# EAGLE design AutoTunerV2 (EAGLE 9.6.2)

## Sheet 1 of 4: mcu
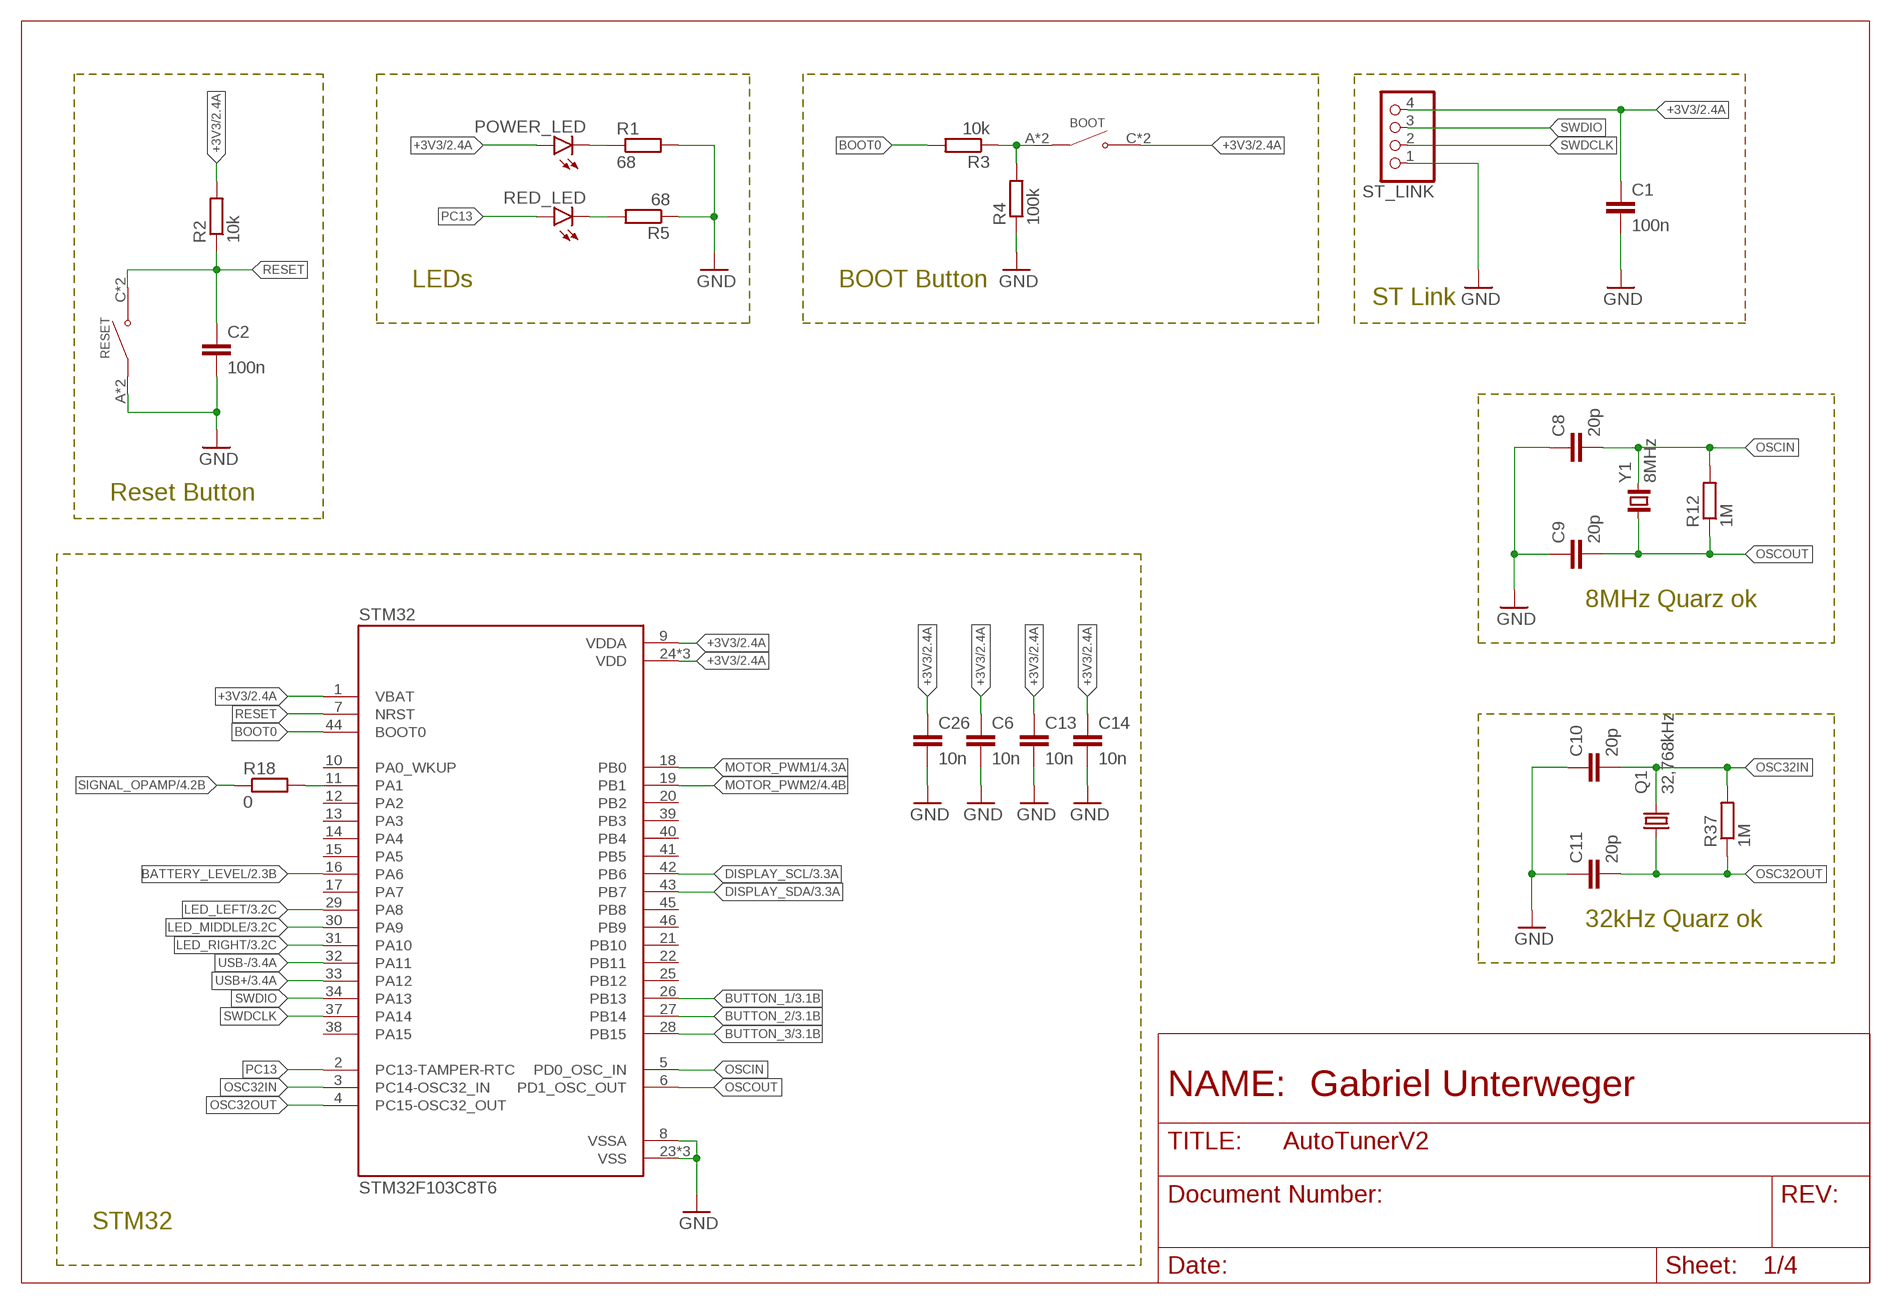
[diagram p0: schematic, sheet 1]

### Parts
BOOT  TS-1187A-B-A-B  [SW_TS-1187A-B-A-B]
C1  100n  C-EUC0805  [C0805]
C2  100n  C-EUC0805  [C0805]
C6  10n  C-EUC0805  [C0805]
C8  20p  C-EUC0805  [C0805]
C9  20p  C-EUC0805  [C0805]
C10  20p  C-EUC0805  [C0805]
C11  20p  C-EUC0805  [C0805]
C13  10n  C-EUC0805  [C0805]
C14  10n  C-EUC0805  [C0805]
C26  10n  C-EUC0805  [C0805]
POWER_LED  LEDCHIPLED_0805  [CHIPLED_0805]
Q1  32,768kHz  KX-327-NHF  [3.2X1.5]
R1  68  R-EU_R0805  [R0805]
R2  10k  R-EU_R0805  [R0805]
R3  10k  R-EU_R0805  [R0805]
R4  100k  R-EU_R0805  [R0805]
R5  68  R-EU_R0805  [R0805]
R12  1M  R-EU_R0805  [R0805]
R18  0  R-EU_R0805  [R0805]
R37  1M  R-EU_R0805  [R0805]
RED_LED  LEDCHIPLED_0805  [CHIPLED_0805]
RESET  TS-1187A-B-A-B  [SW_TS-1187A-B-A-B]
ST_LINK  PINHD-1X4  [1X04]
STM32  STM32F103C8T6  [QFP50P900X900X160-48N]
Y1  8MHz  CRYSTAL_NX5032GA  [CRYSTAL_2-SMD-5X3]

### Nets
+3V3: BOOT.C(NO) BOOT.D(NO) C1.1 C6.1 C13.1 C14.1 C26.1 POWER_LED.A R2.2 ST_LINK.4 STM32.1(VBAT) STM32.9(VDDA) STM32.24(VDD) STM32.36(VDD) STM32.48(VDD) ; also sheet 2,3,4
BATTERY_LEVEL: STM32.16(PA6) ; also sheet 2
BOOT0: R3.2 STM32.44(BOOT0)
BUTTON_1: STM32.26(PB13) ; also sheet 3
BUTTON_2: STM32.27(PB14) ; also sheet 3
BUTTON_3: STM32.28(PB15) ; also sheet 3
DISPLAY_SCL: STM32.42(PB6) ; also sheet 3
DISPLAY_SDA: STM32.43(PB7) ; also sheet 3
GND: C1.2 C2.2 C6.2 C8.1 C9.1 C10.1 C11.1 C13.2 C14.2 C26.2 R1.2 R4.1 R5.1 RESET.A(COM) RESET.B(COM) ST_LINK.1 STM32.8(VSSA) STM32.23(VSS) STM32.35(VSS) STM32.47(VSS) ; also sheet 2,3,4
LED_LEFT: STM32.29(PA8) ; also sheet 3
LED_MIDDLE: STM32.30(PA9) ; also sheet 3
LED_RIGHT: STM32.31(PA10) ; also sheet 3
MOTOR_PWM1: STM32.18(PB0) ; also sheet 4
MOTOR_PWM2: STM32.19(PB1) ; also sheet 4
N$2: R5.2 RED_LED.C
N$3: POWER_LED.C R1.1
N$5: BOOT.A(COM) BOOT.B(COM) R3.1 R4.2
N$45: R18.2 STM32.11(PA1)
OSC32IN: C10.2 Q1.2 R37.2 STM32.3(PC14-OSC32_IN)
OSC32OUT: C11.2 Q1.1 R37.1 STM32.4(PC15-OSC32_OUT)
OSCIN: C8.2 R12.2 STM32.5(PD0_OSC_IN) Y1.2
OSCOUT: C9.2 R12.1 STM32.6(PD1_OSC_OUT) Y1.1
PC13: RED_LED.A STM32.2(PC13-TAMPER-RTC)
RESET: C2.1 R2.1 RESET.C(NO) RESET.D(NO) STM32.7(NRST)
SIGNAL_OPAMP: R18.1 ; also sheet 4
SWDCLK: ST_LINK.2 STM32.37(PA14)
SWDIO: ST_LINK.3 STM32.34(PA13)
USB+: STM32.33(PA12) ; also sheet 3
USB-: STM32.32(PA11) ; also sheet 3
Unconnected: STM32.10(PA0_WKUP) STM32.12(PA2) STM32.13(PA3) STM32.14(PA4) STM32.15(PA5) STM32.17(PA7) STM32.20(PB2) STM32.21(PB10) STM32.22(PB11) STM32.25(PB12) STM32.38(PA15) STM32.39(PB3) STM32.40(PB4) STM32.41(PB5) STM32.45(PB8) STM32.46(PB9)

### Notes on the sheet
- LEDs | BOOT Button
- ST Link
- Reset Button
- 8MHz Quarz ok
- 32kHz Quarz ok
- STM32

## Sheet 2 of 4: battery / voltage converter
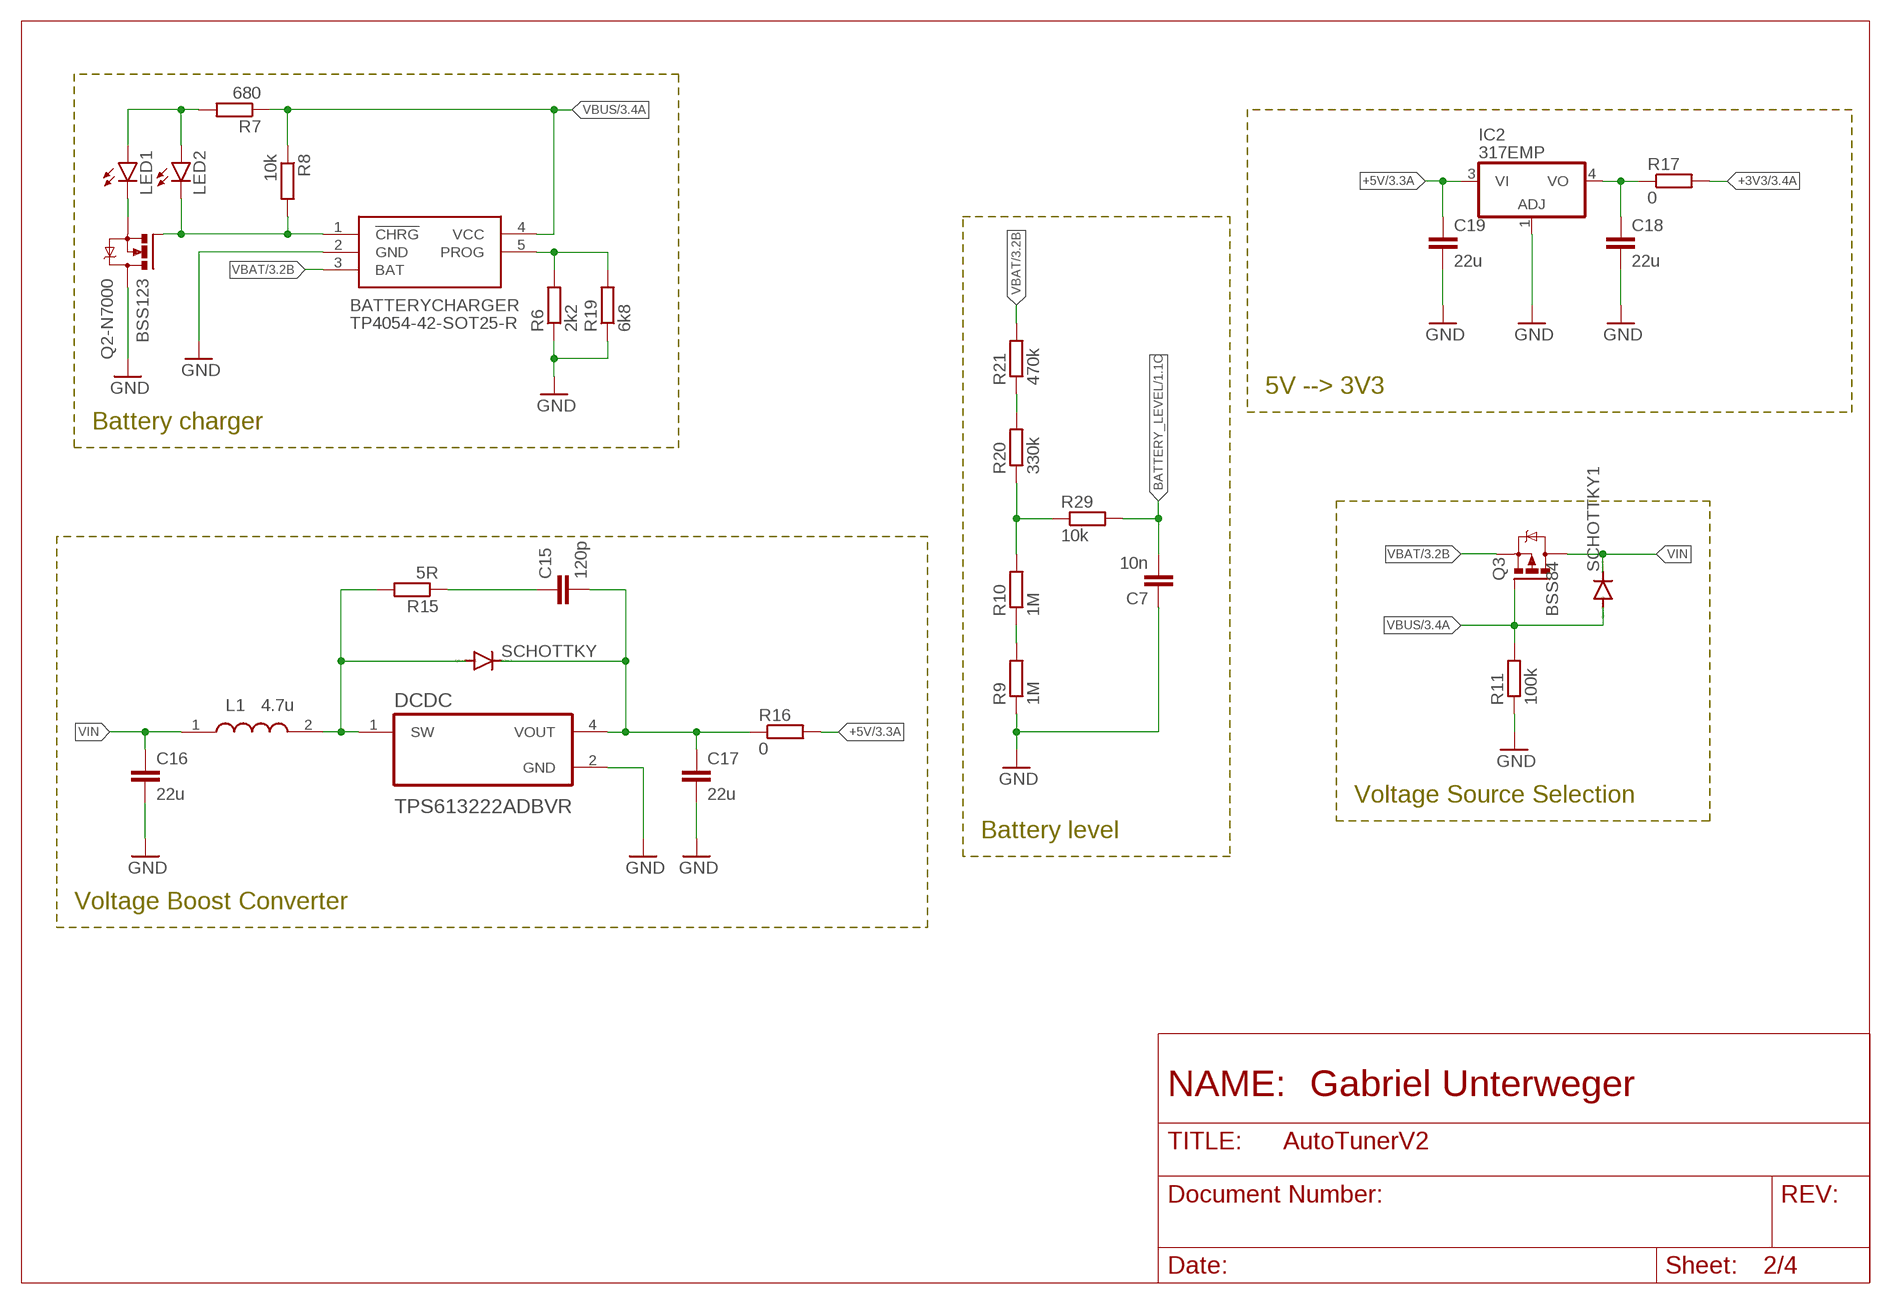
[diagram p1: schematic, sheet 2]

### Parts
BATTERYCHARGER  TP4054-42-SOT25-R  [SOT95P280X100-5N]
C7  10n  C-EUC0805  [C0805]
C15  120p  C-EUC0805  [C0805]
C16  22u  C-EUC1206  [C1206]
C17  22u  C-EUC1206  [C1206]
C18  22u  C-EUC1206  [C1206]
C19  22u  C-EUC1206  [C1206]
DCDC  TPS613222ADBVR  [SOT95P280X145-5N]
IC2  317EMP  [SOT223]
L1  4.7u  DFE252012P-4R7M=P2  [DFE2HCAH1R0MJ0L]
LED1  LEDCHIPLED_0805  [CHIPLED_0805]
LED2  LEDCHIPLED_0805  [CHIPLED_0805]
Q2-N7000  BSS123  NMOSFET_BSS123_SOT23-GSD  [SOT23]
Q3  BSS84  PMOSFET_BSS84_SOT23-GSD  [SOT23]
R6  2k2  R-EU_R0805  [R0805]
R7  680  R-EU_R0805  [R0805]
R8  10k  R-EU_R0805  [R0805]
R9  1M  R-EU_R0805  [R0805]
R10  1M  R-EU_R0805  [R0805]
R11  100k  R-EU_R0805  [R0805]
R15  5R  R-EU_R0805  [R0805]
R16  0  R-EU_R0805  [R0805]
R17  0  R-EU_R0805  [R0805]
R19  6k8  R-EU_R0805  [R0805]
R20  330k  R-EU_R0805  [R0805]
R21  470k  R-EU_R0805  [R0805]
R29  10k  R-EU_R0805  [R0805]
SCHOTTKY  DIODE-SOD323-R  [SOD323-R]
SCHOTTKY1  DIODE-SOD323-R  [SOD323-R]

### Nets
+3V3: R17.2 ; also sheet 1,3,4
+5V: C19.1 IC2.3(VI) R16.2 ; also sheet 3
BATTERY_LEVEL: C7.2 R29.2 ; also sheet 1
GND: BATTERYCHARGER.2(GND) C7.1 C16.2 C17.2 C18.2 C19.2 DCDC.2(GND) IC2.1(ADJ) Q2-N7000.3(D) R6.1 R9.1 R11.1 R19.1 ; also sheet 1,3,4
N$1: DCDC.1(SW) L1.2 R15.2 SCHOTTKY.A
N$4: R9.2 R10.1
N$7: C15.2 C17.1 DCDC.4(VOUT) R16.1 SCHOTTKY.C
N$8: BATTERYCHARGER.5(PROG) R6.2 R19.2
N$9: BATTERYCHARGER.1(!CHRG) LED2.C Q2-N7000.1(G) R8.2
N$10: C15.1 R15.1
N$11: LED1.A LED2.A R7.2
N$12: LED1.C Q2-N7000.2(S)
N$13: C18.1 IC2.4(VO) R17.1
N$46: R20.2 R21.1
N$47: R10.2 R20.1 R29.1
VBAT: BATTERYCHARGER.3(BAT) Q3.2(S) R21.2 ; also sheet 3,4
VBUS: BATTERYCHARGER.4(VCC) Q3.1(G) R7.1 R8.1 R11.2 SCHOTTKY1.A ; also sheet 3
VIN: C16.1 L1.1 Q3.3(D) SCHOTTKY1.C

### Notes on the sheet
- 5V --> 3V3
- Battery charger
- Voltage Source Selection
- Battery level
- Voltage Boost Converter

## Sheet 3 of 4: I/O
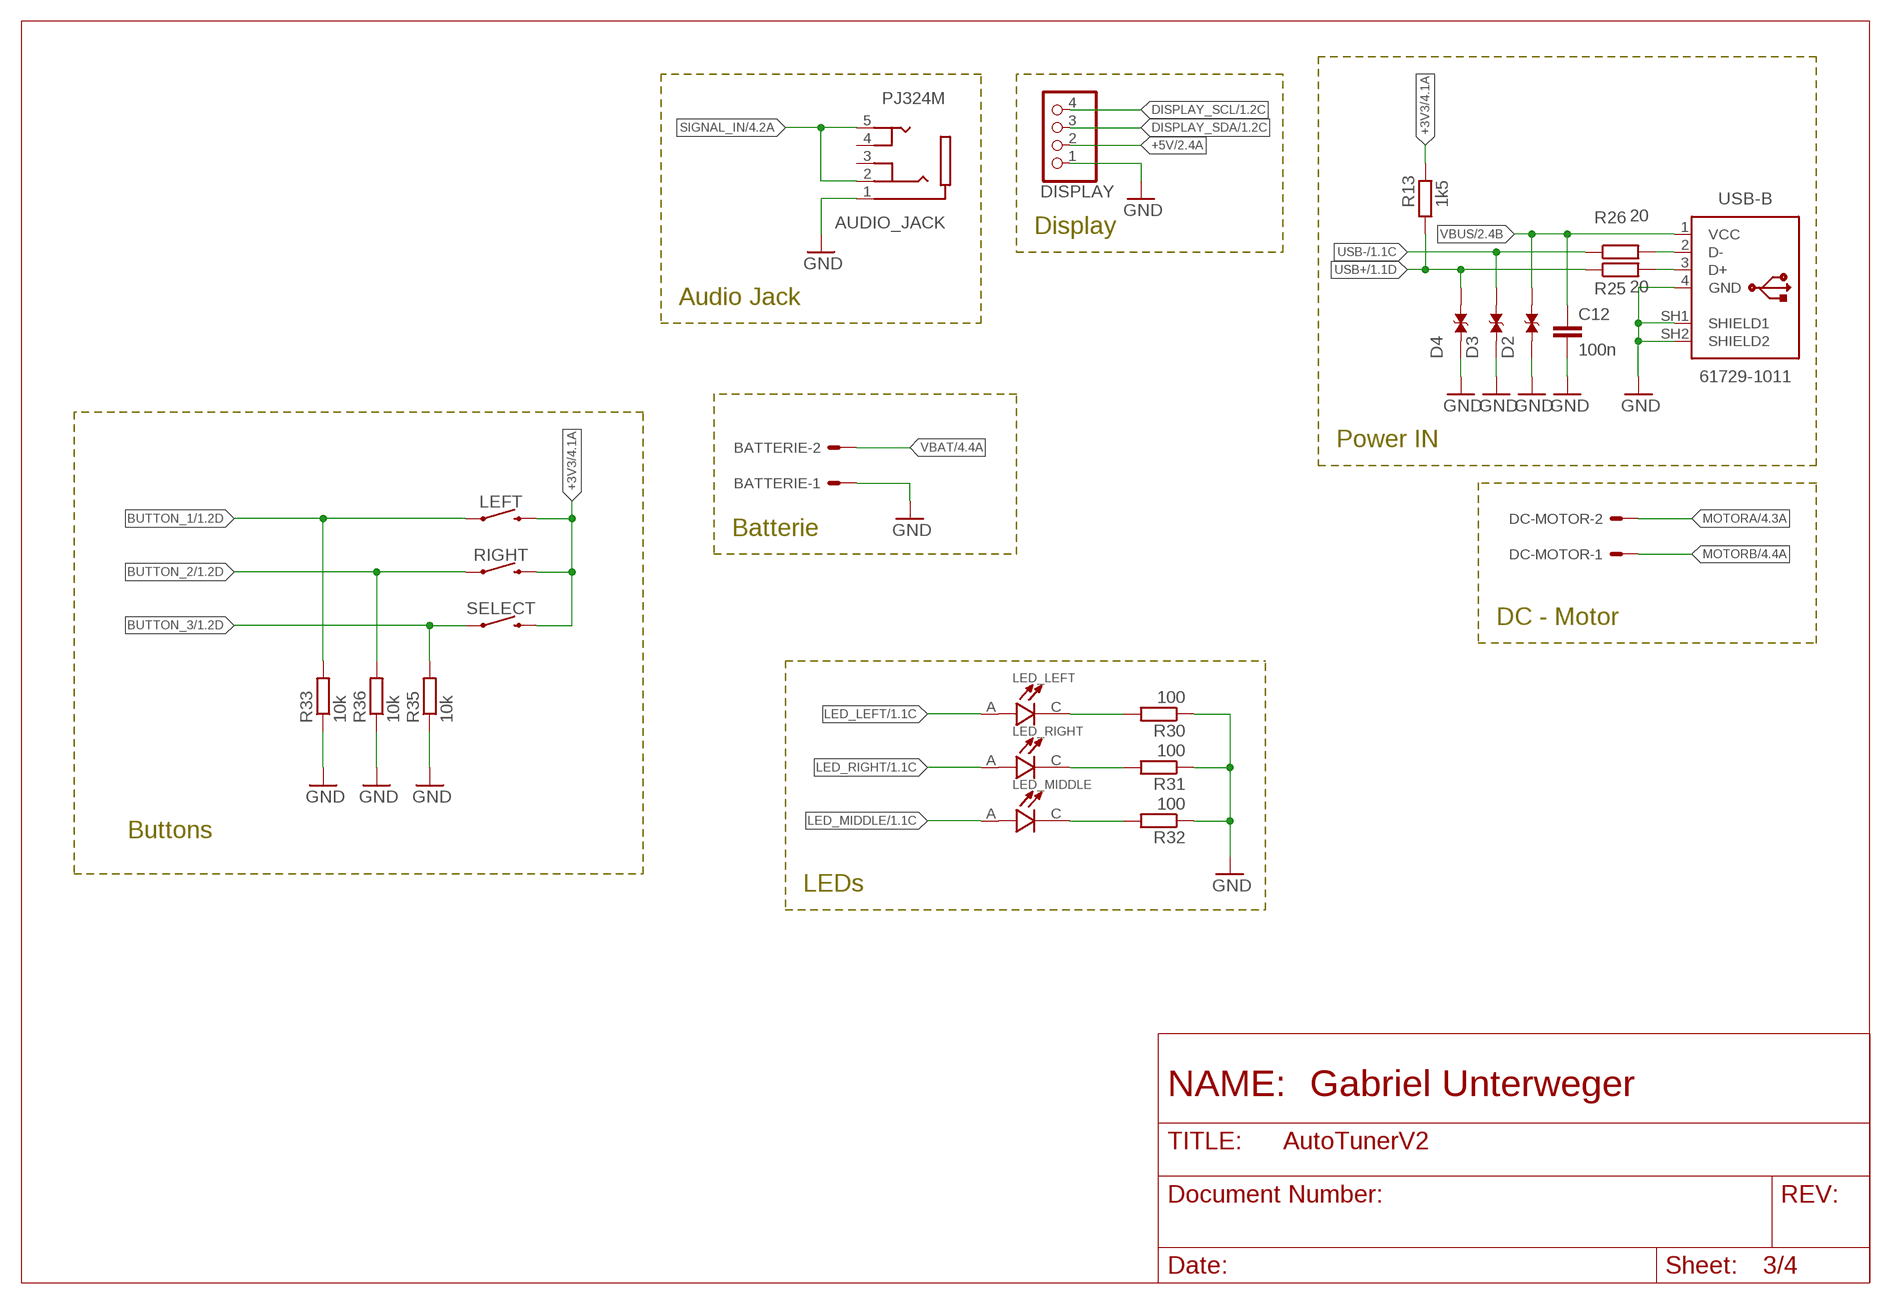
[diagram p2: schematic, sheet 3]

### Parts
AUDIO_JACK  PJ324M  [WENZHOU_PJ324M]
BATTERIE  22-27-2021-02  [6410-02]
C12  100n  C-EUC0805  [C0805]
D2  TESD5V0L1UC_RJG  [DIO_TESD5V0L1UC_RJG]
D3  TESD5V0L1UC_RJG  [DIO_TESD5V0L1UC_RJG]
D4  TESD5V0L1UC_RJG  [DIO_TESD5V0L1UC_RJG]
DC-MOTOR  22-27-2021-02  [6410-02]
DISPLAY  PINHD-1X4  [1X04]
LED_LEFT  L-53GD  [LEDRD254W50D500H1060]
LED_MIDDLE  L-53GD  [LEDRD254W50D500H1060]
LED_RIGHT  L-53GD  [LEDRD254W50D500H1060]
LEFT  MOMENTARY-SWITCH-SPST-PTH-12MM  [TACTILE_SWITCH_PTH_12MM]
R13  1k5  R-EU_R0805  [R0805]
R25  20  R-EU_R0805  [R0805]
R26  20  R-EU_R0805  [R0805]
R30  100  R-EU_R0805  [R0805]
R31  100  R-EU_R0805  [R0805]
R32  100  R-EU_R0805  [R0805]
R33  10k  R-EU_R0805  [R0805]
R35  10k  R-EU_R0805  [R0805]
R36  10k  R-EU_R0805  [R0805]
RIGHT  MOMENTARY-SWITCH-SPST-PTH-12MM  [TACTILE_SWITCH_PTH_12MM]
SELECT  MOMENTARY-SWITCH-SPST-PTH-12MM  [TACTILE_SWITCH_PTH_12MM]
USB-B  61729-1011  [61729-1011BLF]

### Nets
+3V3: LEFT.3 R13.2 RIGHT.3 SELECT.3 ; also sheet 1,2,4
+5V: DISPLAY.2 ; also sheet 2
BUTTON_1: LEFT.1 R33.2 ; also sheet 1
BUTTON_2: R36.2 RIGHT.1 ; also sheet 1
BUTTON_3: R35.2 SELECT.1 ; also sheet 1
DISPLAY_SCL: DISPLAY.4 ; also sheet 1
DISPLAY_SDA: DISPLAY.3 ; also sheet 1
GND: AUDIO_JACK.1(SLEEVE) BATTERIE.1 C12.2 D2.1 D3.1 D4.1 DISPLAY.1 R30.1 R31.1 R32.1 R33.1 R35.1 R36.1 USB-B.4(GND) USB-B.SH1(SHIELD1) USB-B.SH2(SHIELD2) ; also sheet 1,2,4
LED_LEFT: LED_LEFT.A ; also sheet 1
LED_MIDDLE: LED_MIDDLE.A ; also sheet 1
LED_RIGHT: LED_RIGHT.A ; also sheet 1
MOTORA: DC-MOTOR.2 ; also sheet 4
MOTORB: DC-MOTOR.1 ; also sheet 4
N$19: LED_LEFT.C R30.2
N$20: LED_RIGHT.C R31.2
N$23: LED_MIDDLE.C R32.2
N$29: R25.2 USB-B.3(D+)
N$30: R26.2 USB-B.2(D-)
SIGNAL_IN: AUDIO_JACK.2(RING_1) AUDIO_JACK.5(TIP_2) ; also sheet 4
USB+: D4.2 R13.1 R25.1 ; also sheet 1
USB-: D3.2 R26.1 ; also sheet 1
VBAT: BATTERIE.2 ; also sheet 2,4
VBUS: C12.1 D2.2 USB-B.1(VCC) ; also sheet 2
Unconnected: AUDIO_JACK.3(RING_2) AUDIO_JACK.4(TIP_1)

### Notes on the sheet
- Display
- Audio Jack
- Power IN
- Batterie
- DC - Motor
- Buttons
- LEDs

## Sheet 4 of 4: Motor Steuerung / Signal Verarbeitung
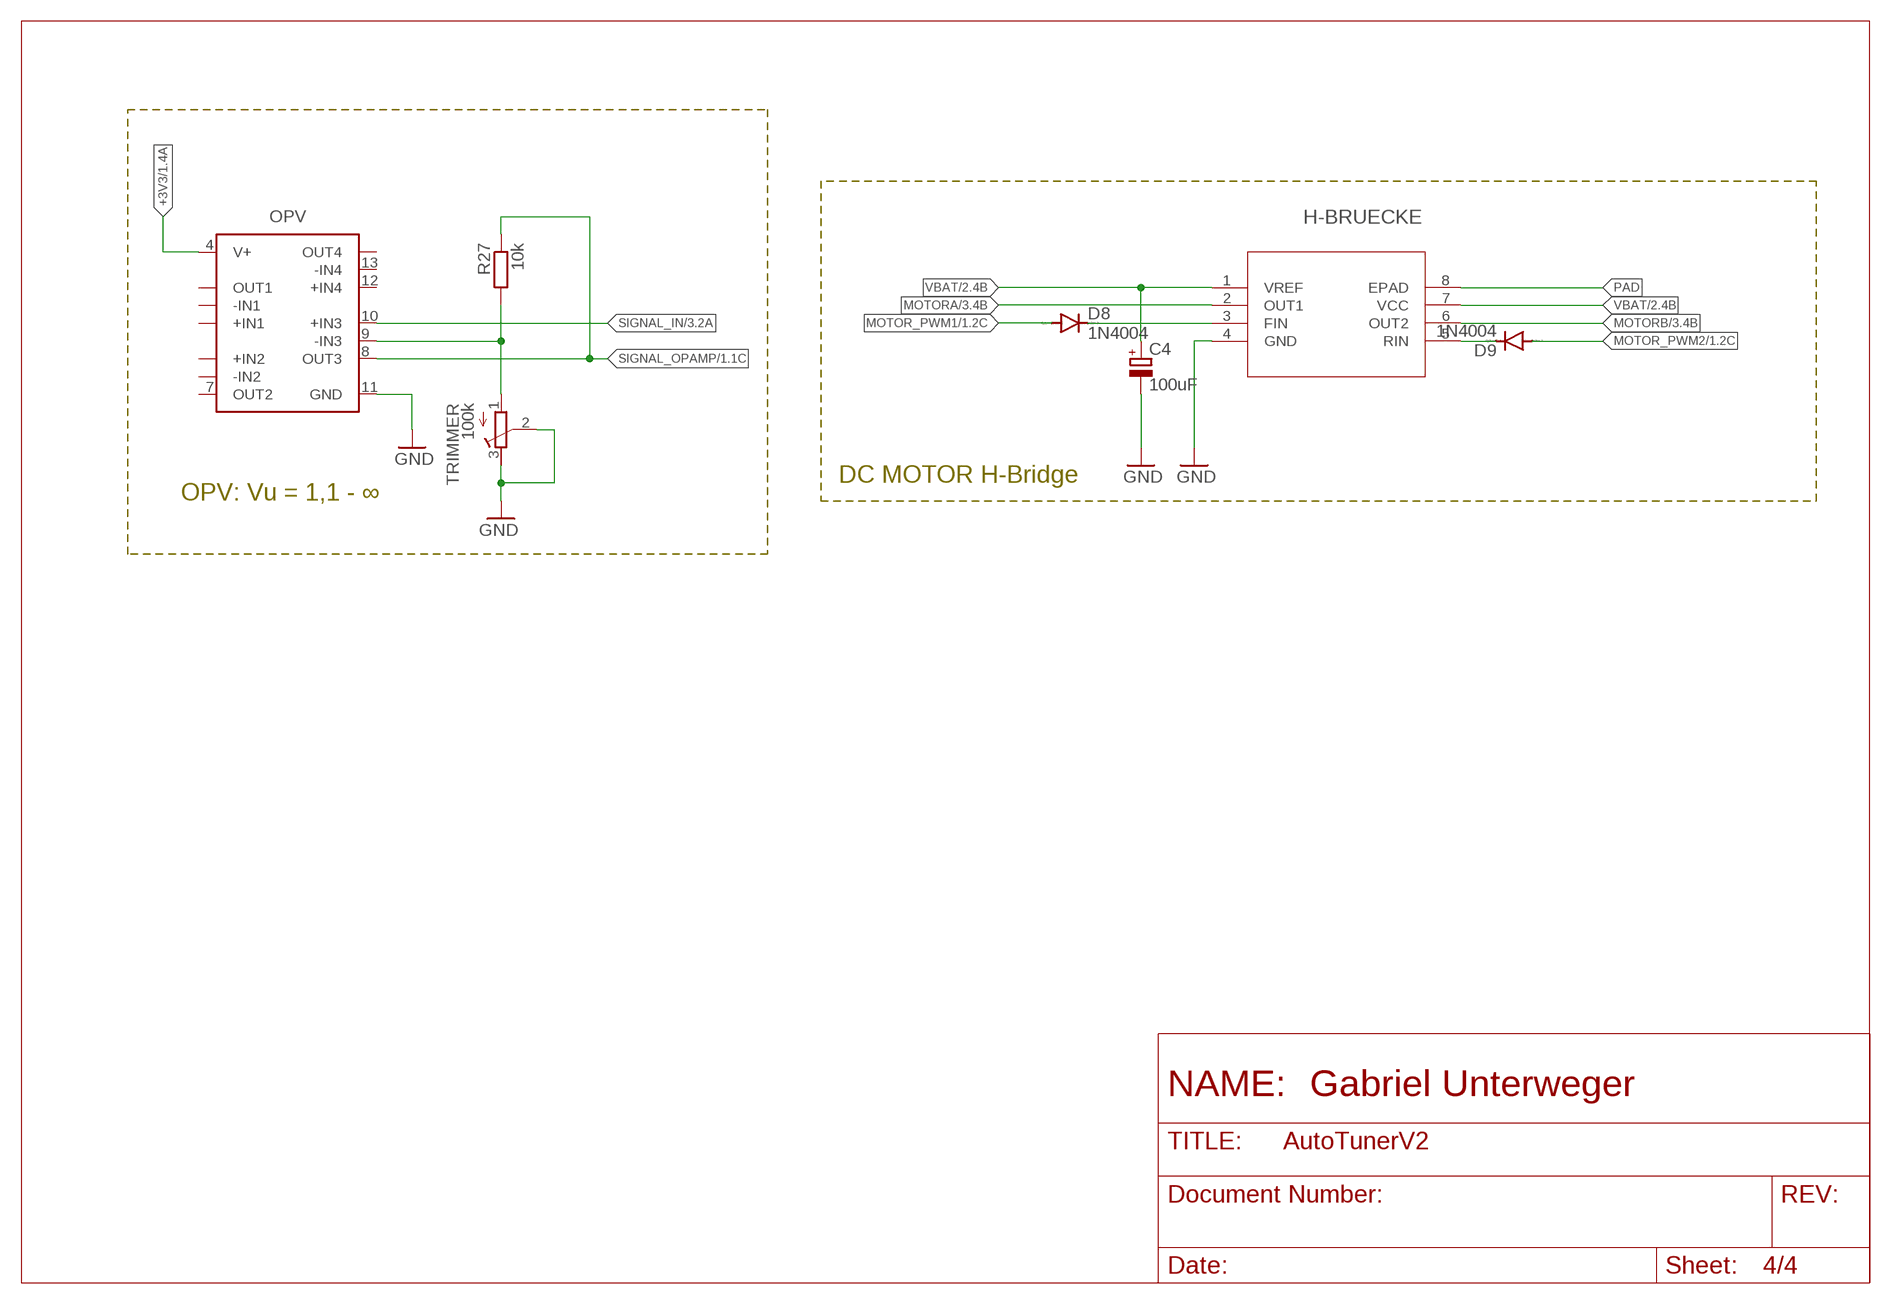
[diagram p3: schematic, sheet 4]

### Parts
C4  100uF  CPOL-EUB45181A  [B45181A]
D8  1N4004  [DO41-10]
D9  1N4004  [DO41-10]
H-BRUECKE  BD6222HFP-TRHRP7_ROM-M  [HRP7_ROM-M]
OPV  LM324_SOIC  [SOIC127P600X175-14N]
R27  10k  R-EU_R0805  [R0805]
TRIMMER  100k  R-TRIMM64Y  [RTRIM64Y]

### Nets
+3V3: OPV.4(V+) ; also sheet 1,2,3
GND: C4.- H-BRUECKE.4(GND) OPV.11(GND) TRIMMER.2(S) TRIMMER.3(E) ; also sheet 1,2,3
MOTOR_PWM1: D8.A ; also sheet 1
MOTOR_PWM2: D9.A ; also sheet 1
MOTORA: H-BRUECKE.2(OUT1) ; also sheet 3
MOTORB: H-BRUECKE.6(OUT2) ; also sheet 3
N$6: D8.C H-BRUECKE.3(FIN)
N$14: D9.C H-BRUECKE.5(RIN)
N$16: OPV.9(-IN3) R27.2 TRIMMER.1(A)
PAD: H-BRUECKE.8(EPAD)
SIGNAL_IN: OPV.10(+IN3) ; also sheet 3
SIGNAL_OPAMP: OPV.8(OUT3) R27.1 ; also sheet 1
VBAT: C4.+ H-BRUECKE.1(VREF) H-BRUECKE.7(VCC) ; also sheet 2,3
Unconnected: OPV.1(OUT1) OPV.2(-IN1) OPV.3(+IN1) OPV.5(+IN2) OPV.6(-IN2) OPV.7(OUT2) OPV.12(+IN4) OPV.13(-IN4) OPV.14(OUT4)

### Notes on the sheet
- DC MOTOR H-Bridge
- OPV: Vu = 1,1 - ∞

## Library data of the parts
AUDIO_JACK = PJ324M:PJ324M: Headphone Stereo jack/Audio connector Check availability <https://pricing.snapeda.com/parts/PJ324M/Wenzhou%20QingPu%20Electronics%20Co.Ltd/view-part?ref=eda>; AVAILABILITY: Not in stock; CHECK_PRICES: https://www.snapeda.com/parts/PJ324M/Wenzhou+QingPu+Electronics+Co.Ltd/view-part/?ref=eda; DESCRIPTION: Headphone Stereo jack/Audio connector; MF: Wenzhou QingPu Electronics Co.Ltd; MP: PJ324M; PACKAGE: Package; PRICE: None; SNAPEDA_LINK: https://www.snapeda.com/parts/PJ324M/Wenzhou+QingPu+Electronics+Co.Ltd/view-part/?ref=snap
BATTERIE DC-MOTOR = con-molex:22-?-02: CONNECTOR wire to board 2.54 mm (.1 inch) pitch header; MF: MOLEX; OC_FARNELL: unknown; OC_NEWARK: unknown
BATTERYCHARGER = TP4054-42-SOT25-R:TP4054-42-SOT25-R: Standalone Linear Li-ion Battery Charger with Thermal Regulation, SOT-23-5 Source: Datasheet <http://images.100y.com.tw/pdf_file/38-TP-TP4054x.pdf>; DESCRIPTION: Standalone Linear Li-ion Battery Charger with Thermal Regulation, SOT-23-5; HEIGHT: 1mm; LCSC_PART: C32574; MANUFACTURER_NAME: TOP POWER; MANUFACTURER_PART_NUMBER: TP4054-42-SOT25-R
BOOT RESET = TS-1187A-B-A-B:TS-1187A-B-A-B: SPST 50mA @ 12VDC Top Actuated Round Button 160gf SMD Tactile Switches RoHS Check availability <https://pricing.snapeda.com/parts/TS-1187A-B-A-B/XKB%20Industrial%20Precision/view-part?ref=eda>; AVAILABILITY: Not in stock; DESCRIPTION: TS-1187A-B-A-B XKB Connectivity; LCSC_PART: C318884; MF: XKB Industrial Precision; MP: TS-1187A-B-A-B; PACKAGE: Package; PRICE: None
C1 C2 C6-C15 C26 = rcl:C-EU: CAPACITOR, European symbol; SPICEPREFIX: C
C4 = rcl:CPOL-EU: POLARIZED CAPACITOR, European symbol; SPICEPREFIX: C
C16-C19 = rcl:C-EU: CAPACITOR, European symbol; LCSC_PART: C5672; SPICEPREFIX: C
D2-D4 = TESD5V0L1UC_RJG:TESD5V0L1UC_RJG: Check availability <https://pricing.snapeda.com/parts/TESD5V0L1UC%20RJG/Taiwan%20Semiconductor%20Corporation/view-part?ref=eda>; AVAILABILITY: In Stock; CHECK_PRICES: https://www.snapeda.com/parts/TESD5V0L1UC%20RJG/Taiwan+Semiconductor/view-part/?ref=eda; DESCRIPTION: DFN1006L, 5V, 100W, 2pF, ESD Protection Diode & Array; LCSC_PART: C7420372; MF: Taiwan Semiconductor Corporation; MP: TESD5V0L1UC RJG; PACKAGE: DFN1006L Taiwan Semiconductor; PRICE: None; PURCHASE-URL: https://www.snapeda.com/api/url_track_click_mouser/?unipart_id=3789592&manufacturer=Taiwan Semiconductor Corporation&part_name=TESD5V0L1UC RJG&search_term=protection diode; SNAPEDA_LINK: https://www.snapeda.com/parts/TESD5V0L1UC%20RJG/Taiwan+Semiconductor/view-part/?ref=snap
D8 D9 = diode:1N4004: DIODE general purpose rectifier, 1 A
DCDC = TPS613222ADBVR:TPS613222ADBVR: Check availability <https://pricing.snapeda.com/parts/TPS613222ADBVR/Texas%20Instruments/view-part?ref=eda>; AVAILABILITY: In Stock; CHECK_PRICES: https://www.snapeda.com/parts/TPS613222ADBVR/Texas+Instruments/view-part/?ref=eda; DESCRIPTION: 6-uA Quiescent Current, 1.8-A Switch Current Boost Converter; LCSC_PART: C2071163; MF: Texas Instruments; MP: TPS613222ADBVR; PACKAGE: SOT-23-5 Texas Instruments; PRICE: None; PURCHASE-URL: https://www.snapeda.com/api/url_track_click_mouser/?unipart_id=2771858&manufacturer=Texas Instruments&part_name=TPS613222ADBVR&search_term=tps613222a; SNAPEDA_LINK: https://www.snapeda.com/parts/TPS613222ADBVR/Texas+Instruments/view-part/?ref=snap
DISPLAY ST_LINK = pinhead:PINHD-1X4: PIN HEADER
H-BRUECKE = H-Brücke_BD622HFP-TR02:BD6222HFP-TR; COPYRIGHT: Copyright (C) 2022 Ultra Librarian. All rights reserved.; MANUFACTURER_PART_NUMBER: BD6222HFP-TR; MFR_NAME: ROHM Semiconductor
IC2 = linear:*317: Positive VOLTAGE REGULATOR; LCSC_PART: C6186
L1 = DFE252012P-4R7M=P2:DFE252012P-4R7M=P2: Toko DFE252012P Series Shielded Wire-wound SMD Inductor with a Powered Iron Core, 4.7 uH Wire-Wound 2.2A Idc Source: Datasheet <https://psearch.en.murata.com/inductor/product/DFE252012P-4R7M#.html>; ARROW_PART_NUMBER: DFE252012P-4R7M=P2; ARROW_PRICE-STOCK: https://www.arrow.com/en/products/dfe252012p-4r7mp2/murata-manufacturing?region=europe; DESCRIPTION: Toko DFE252012P Series Shielded Wire-wound SMD Inductor with a Powered Iron Core, 4.7 uH Wire-Wound 2.2A Idc; HEIGHT: 1.2mm; LCSC_PART: C3093670; MANUFACTURER_NAME: Murata Electronics; MANUFACTURER_PART_NUMBER: DFE252012P-4R7M=P2; MOUSER_PART_NUMBER: 81-DFE252012P-4R7MP2; MOUSER_PRICE-STOCK: https://www.mouser.co.uk/ProductDetail/Murata-Electronics/DFE252012P-4R7M%3dP2?qs=KuGPmAKtFKVp8Hnp6vDIBg%3D%3D
LED1 POWER_LED = led:LED: LED OSRAM: - CHIPLED LG R971, LG N971, LY N971, LG Q971, LY Q971, LO R971, LY R971 LH N974, LH R974 LS Q976, LO Q976, LY Q976 LO Q996 - Hyper CHIPLED LW Q18S LB Q993, LB Q99A, LB R99A - SideLED LS A670, LO A670, LY A670, LG A670, LP A670 LB A673, LV A673, LT A673, LW A673 LH A674 LY A675 LS A676, LA A676, LO A676, LY A676, LW A676 LS A679, LY A679, LG A679 - Hyper Micro SIDELED® LS Y876, LA Y876, LO Y876, LY Y876 LT Y87S - SmartLED LW L88C, LW L88S LB L89C, LB L89S, LG L890 LS L89K, LO L89K, LY L89K LS L896, LA L896, LO L896, LY L896 - TOPLED LS T670, LO T670, LY T670, LG T670, LP T670 LSG T670, LSP T670, LSY T670, LOP T670, LYG T670 LG T671, LOG T671, LSG T671 LB T673, LV T673, LT T673, LW T673 LH T674 LS T676, LA T676, LO T676, LY T676, LB T676, LH T676, LSB T676, LW T676 LB T67C, LV T67C, LT T67C, LS T67K, LO T67K, LY T67K, LW E67C LS E67B, LA E67B, LO E67B, LY E67B, LB E67C, LV E67C, LT E67C LW T67C LS T679, LY T679, LG T679 LS T770, LO T770, LY T770, LG T770, LP T770 LB T773, LV T773, LT T773, LW T773 LH T774 LS E675, LA E675, LY E675, LS T675 LS T776, LA T776, LO T776, LY T776, LB T776 LHGB T686 LT T68C, LB T68C - Hyper Mini TOPLED® LB M676 - Mini TOPLED Santana® LG M470 LS M47K, LO M47K, LY M47K Source: http://www.osram.convergy.de LUXEON: - LUMILED® LXK2-PW12-R00, LXK2-PW12-S00, LXK2-PW14-U00, LXK2-PW14-V00 LXK2-PM12-R00, LXK2-PM12-S00, LXK2-PM14-U00 LXK2-PE12-Q00, LXK2-PE12-R00, LXK2-PE12-S00, LXK2-PE14-T00, LXK2-PE14-U00 LXK2-PB12-K00, LXK2-PB12-L00, LXK2-PB12-M00, LXK2-PB14-N00, LXK2-PB14-P00, LXK2-PB14-Q00 LXK2-PR12-L00, LXK2-PR12-M00, LXK2-PR14-Q00, LXK2-PR14-R00 LXK2-PD12-Q00, LXK2-PD12-R00, LXK2-PD12-S00 LXK2-PH12-R00, LXK2-PH12-S00 LXK2-PL12-P00, LXK2-PL12-Q00, LXK2-PL12-R00 Source: www.luxeon.com KINGBRIGHT: KA-3528ASYC Source: www.kingbright.com; LCSC_PART: C2297
LED2 RED_LED = led:LED: LED OSRAM: - CHIPLED LG R971, LG N971, LY N971, LG Q971, LY Q971, LO R971, LY R971 LH N974, LH R974 LS Q976, LO Q976, LY Q976 LO Q996 - Hyper CHIPLED LW Q18S LB Q993, LB Q99A, LB R99A - SideLED LS A670, LO A670, LY A670, LG A670, LP A670 LB A673, LV A673, LT A673, LW A673 LH A674 LY A675 LS A676, LA A676, LO A676, LY A676, LW A676 LS A679, LY A679, LG A679 - Hyper Micro SIDELED® LS Y876, LA Y876, LO Y876, LY Y876 LT Y87S - SmartLED LW L88C, LW L88S LB L89C, LB L89S, LG L890 LS L89K, LO L89K, LY L89K LS L896, LA L896, LO L896, LY L896 - TOPLED LS T670, LO T670, LY T670, LG T670, LP T670 LSG T670, LSP T670, LSY T670, LOP T670, LYG T670 LG T671, LOG T671, LSG T671 LB T673, LV T673, LT T673, LW T673 LH T674 LS T676, LA T676, LO T676, LY T676, LB T676, LH T676, LSB T676, LW T676 LB T67C, LV T67C, LT T67C, LS T67K, LO T67K, LY T67K, LW E67C LS E67B, LA E67B, LO E67B, LY E67B, LB E67C, LV E67C, LT E67C LW T67C LS T679, LY T679, LG T679 LS T770, LO T770, LY T770, LG T770, LP T770 LB T773, LV T773, LT T773, LW T773 LH T774 LS E675, LA E675, LY E675, LS T675 LS T776, LA T776, LO T776, LY T776, LB T776 LHGB T686 LT T68C, LB T68C - Hyper Mini TOPLED® LB M676 - Mini TOPLED Santana® LG M470 LS M47K, LO M47K, LY M47K Source: http://www.osram.convergy.de LUXEON: - LUMILED® LXK2-PW12-R00, LXK2-PW12-S00, LXK2-PW14-U00, LXK2-PW14-V00 LXK2-PM12-R00, LXK2-PM12-S00, LXK2-PM14-U00 LXK2-PE12-Q00, LXK2-PE12-R00, LXK2-PE12-S00, LXK2-PE14-T00, LXK2-PE14-U00 LXK2-PB12-K00, LXK2-PB12-L00, LXK2-PB12-M00, LXK2-PB14-N00, LXK2-PB14-P00, LXK2-PB14-Q00 LXK2-PR12-L00, LXK2-PR12-M00, LXK2-PR14-Q00, LXK2-PR14-R00 LXK2-PD12-Q00, LXK2-PD12-R00, LXK2-PD12-S00 LXK2-PH12-R00, LXK2-PH12-S00 LXK2-PL12-P00, LXK2-PL12-Q00, LXK2-PL12-R00 Source: www.luxeon.com KINGBRIGHT: KA-3528ASYC Source: www.kingbright.com; LCSC_PART: C84256
LED_LEFT LED_MIDDLE LED_RIGHT = L-53GD:L-53GD: LED; 5mm; green; 5-32mcd; 60°; Front: convex Check availability <https://pricing.snapeda.com/parts/L-53GD/Kingbright/view-part?ref=eda>; AVAILABILITY: In Stock; CHECK_PRICES: https://www.snapeda.com/parts/L-53GD/Kingbright/view-part/?ref=eda; DESCRIPTION: LED; 5mm; green; 5-32mcd; 60°; Front: convex; MF: Kingbright; MP: L-53GD; PACKAGE: CDIP-28 Kingbright; PRICE: None; PURCHASE-URL: https://www.snapeda.com/api/url_track_click_mouser/?unipart_id=525636&manufacturer=Kingbright&part_name=L-53GD&search_term=led, 5mm; SNAPEDA_LINK: https://www.snapeda.com/parts/L-53GD/Kingbright/view-part/?ref=snap
LEFT RIGHT SELECT = SparkFun-Switches:MOMENTARY-SWITCH-SPST: Momentary Switch (Pushbutton) - SPST Normally-open (NO) SPST momentary switches (buttons, pushbuttons). Variants PTH-12MM - 12mm square, through-hole Momentary Pushbutton Switch - 12mm Square <https://www.sparkfun.com/products/9190> (COM-09190) PTH-6.0MM, PTH-6.0MM-KIT - 6.0mm square, through-hole Mini Pushbutton Switch <https://www.sparkfun.com/products/97> (COM-00097) KIT package intended for soldering kit's - only one side of pads' copper is exposed. PTH-RIGHT-ANGLE-KIT - Right-angle, through-hole Right Angle Tactile Button <https://www.sparkfun.com/products/10791> - Used on SparkFun BigTime Watch Kit <https://www.sparkfun.com/products/11734> SMD-12MM - 12mm square, surface-mount Tactile Button - SMD (12mm) <https://www.sparkfun.com/products/12993> (COM-12993) Used on SparkFun PicoBoard <https://www.sparkfun.com/products/11888> SMD-4.5MM - 4.5mm Square Trackball Switch Used on SparkFun Blackberry Trackballer Breakout <https://www.sparkfun.com/products/13169> SMD-4.6MMX2.8MM - 4.60mm x 2.80mm, surface mount Used on SparkFun Pro Micro - RP2040 <https://www.sparkfun.com/products/17717> SMD-5.2MM, SMD-5.2-REDUNDANT - 5.2mm square, surface-mount Mini Pushbutton Switch - SMD <https://www.sparkfun.com/products/8720> (COM-08720) Used on Arduino Pro Mini <https://www.sparkfun.com/products/11114> REDUNDANT package connects both switch circuits together SMD-6.0X3.5MM - 6.0 x 3.5mm, surface mount Momentary Reset Switch SMD <https://www.sparkfun.com/products/8229> (COM-08229) SMD-6.2MM-TALL - 6.2mm square, surface mount Tactile Button - SMD (6mm) <https://www.sparkfun.com/products/12992> Used on SparkFun Digital Sandbox <https://www.sparkfun.com/products/12651> SMD-RIGHT-ANGLE - Right-angle, surface mount Used on SparkFun Block for Intel® Edison - Arduino <https://www.sparkfun.com/products/13036>; PROD_ID: SWCH-09185; SF_SKU: COM-09190
OPV = IC_Linear:LM324: Quad-Operational Amplifiers Reference Datasheet <https://www.ti.com/lit/ds/snosc16d/snosc16d.pdf>; CATEGORY: Operational Amplifiers; DESCRIPTION: Quad-Operational Amplifiers; LCSC_PART: C71035; MANUFACTURER: Generic; MPN: Generic; SERIES: LM324; SUB-CATEGORY: Amplifier ICs; TYPE: Op Amps - Operational Amplifiers
Q1 = crystal-geyer_V1_0:KX-327: Tuning Fork Crystals (kHz) SMD: KX327 - Serie Model Size l/w/h [mm] Frequency Range Frequency Stability Temp. Range [°C] Load Capacitance AECQ 200 availabel Datasheet KX-327VT KX-327FT KX-327RT KX-327NHT KX-327NHF KX-327L KX-327S 1.25/1.05/0.5 1.6/1.0/0.5 2.0/1.2/0.6 3.2/1.5/0.8 3.2/1.5/0.8 7.0/1.5/1.4 8.2/3.8/2.5 32,768 kHz 32,768 kHz 32,768 kHz 32,768 kHz 32,768 kHz 32,768 kHz 32,768 kHz ±10 … ±20ppm ±10 … ±20ppm ±10 … ±20ppm ±10 … ±20ppm ±10 … ±20ppm ±10 … ±20ppm ±5 … ±20ppm (*) -40°C …+85°C (*) -40°C …+85°C (*) -40°C …+85°C (*) -40°C …+85°C (*) -40°C …+125°C (*) -40°C …+85°C (*) -40°C …+85°C 7/9/12,5 7/9/12,5 7/9/12,6 7/9/12,5 9/12,5 7/9/12,5 6/12,5 - - - - yes - - KX-327VT.pdf <http://www.geyer-electronic.de/uploads/tx_userartikelfrequenz/GEYER-KX-327VT.pdf> KX-327FT.pdf <http://www.geyer-electronic.de/uploads/tx_userartikelfrequenz/GEYER-KX-327FT.pdf> KX-327RT.pdf <http://www.geyer-electronic.de/uploads/tx_userartikelfrequenz/GEYER-KX-327RT.pdf> KX-327NHT.pdf <http://www.geyer-electronic.de/uploads/tx_userartikelfrequenz/GEYER-KX-327NHT.pdf> KX-327NHF.pdf <http://www.geyer-electronic.de/uploads/tx_userartikelfrequenz/GEYER-KX-327NHF.pdf> KX-327L.pdf <http://www.geyer-electronic.de/uploads/tx_userartikelfrequenz/GEYER-KX-327L.pdf> KX-327S.pdf <http://www.geyer-electronic.de/uploads/tx_userartikelfrequenz/GEYER-KX-327S.pdf> <http://www.geyer-electronic.de/fileadmin/template/img/logo-geyer-electronic.png> Details see: http://www.geyer-electronic.de/Frequenz-Produkte.9.0.html Created 2016-06-07, Hans Locher 2016 (C) Geyer Quartz Technology KX327VT,KX327FT,KX327RT,KX327NHT,KX327NHF,KX327S,KX327L;125105;1610;2012;3215;7015;8238;1,25x1,05,1.25x1.05;1,6x1,0,1.6x1.0;2,0x1,2,2.0x1.2;3,2x1,5,3.2x1.5;8,2x3,8,8.2x3.8,7.0x1.5,7,0x1,532.768kHz; LCSC_PART: C32346
Q2-N7000 = Transistor:NMOSFET_: N-Channel MOSFET - Popular parts; CATEGORY: Transistor; DESCRIPTION: MOSFET N-CH 100V 0.17A SOT-23; DRAIN_CURRENT: 170mA; LCSC_PART: C20917; MANUFACTURER: ON Semiconductor; MPN: BSS123L; OPERATING_TEMP: -55°C ~ 150°C; PART_STATUS: Active; ROHS_COMPLIANT: Yes; SUB-CATEGORY: MOSFET; THERMALLOSS: 360mW; TYPE: N-Channel
Q3 = Transistor:PMOSFET_: P-Channel MOSFET - Popular parts; CATEGORY: Transistor; DESCRIPTION: MOSFET P-CH 50V 130MA SOT-23; DRAIN_CURRENT: 130mA; LCSC_PARTS: C10487; MANUFACTURER: ON Semiconductor; MPN: BSS84; OPERATING_TEMP: -55°C ~ 150°C; PART_STATUS: Active; ROHS_COMPLIANT: Yes; SUB-CATEGORY: MOSFET; THERMALLOSS: 360mW; TYPE: P-Channel
R1 R5 = rcl:R-EU_: RESISTOR, European symbol; LCSC_PART: C17802; SPICEPREFIX: R
R2-R4 R6-R13 R15-R21 R25-R27 R29-R33 R35-R37 = rcl:R-EU_: RESISTOR, European symbol; SPICEPREFIX: R
SCHOTTKY SCHOTTKY1 = diode:DIODE-: DIODE; LCSC_PART: C191023
STM32 = STM32F103C8T6:STM32F103C8T6: Mainstream Performance line, ARM Cortex-M3 MCU with 64 Kbytes Flash, 72 MHz CPU, motor control, USB and CAN Check availability <https://pricing.snapeda.com/parts/STM32F103C8T6/STMicroelectronics/view-part?ref=eda>; AVAILABILITY: In Stock; CHECK_PRICES: https://www.snapeda.com/parts/STM32F103C8T6/STMicroelectronics/view-part/?ref=eda; DESCRIPTION: ARM® Cortex®-M3 STM32F1 Microcontroller IC 32-Bit 72MHz 64KB (64K x 8) FLASH 48-LQFP (7x7); LCSC_PART: C8734; MF: STMicroelectronics; MP: STM32F103C8T6; PACKAGE: LQFP-48 STMicroelectronics; PRICE: None; PURCHASE-URL: https://www.snapeda.com/api/url_track_click_mouser/?unipart_id=52195&manufacturer=STMicroelectronics&part_name=STM32F103C8T6&search_term=stm32f103c8t6; SNAPEDA_LINK: https://www.snapeda.com/parts/STM32F103C8T6/STMicroelectronics/view-part/?ref=snap
TRIMMER = rcl:R-TRIMM: Trimm resistor; SPICEMODEL: X; SPICEPREFIXL: POT
USB-B = Connector_USB:61729-1011: USB(2.0) Type-B, RCPT, 4POS, THT-R/A Datasheet <https://www.amphenol-icc.com/media/wysiwyg/files/drawing/61729.pdf>; CATEGORY: Connector; CONTACTS: 4; CURRENT_RATING: 1A; DESCRIPTION: CONN RCPT USB2.0 TYPEB 4POS R/A; GENDER: Receptacle; MANUFACTURER: Amphenol ICC (FCI); MOUNT_TYPE: R/A; MPN: 61729-1011BLF; OPERATING_TEMP: -55°C to 85°C; PART_STATUS: Active; ROHS_COMPLIANT: RoHS Compliant; SERIES: 61729; SUB-CATEGORY: USB; TYPE: USB-B
Y1 = 52101-101-REV-A_v16:CRYSTAL_NX5032GA: CRYSTAL; LCSC_PART: C115962

## Board
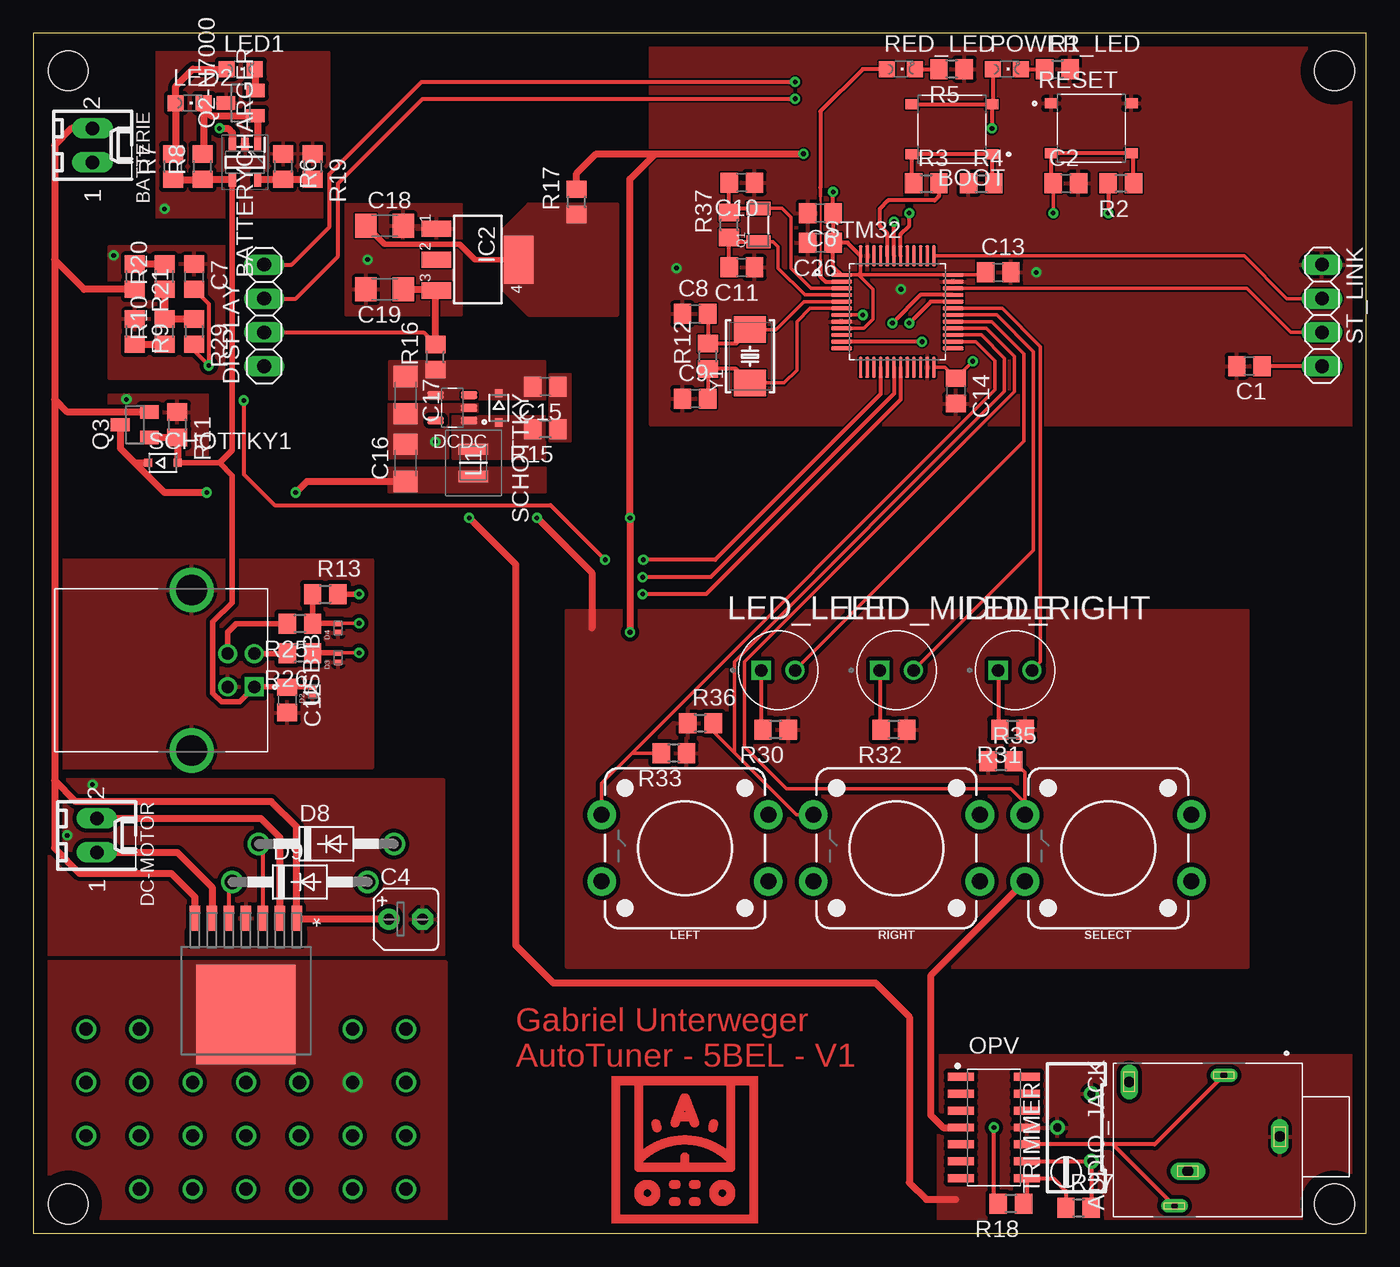
[diagram p4: board, top side]
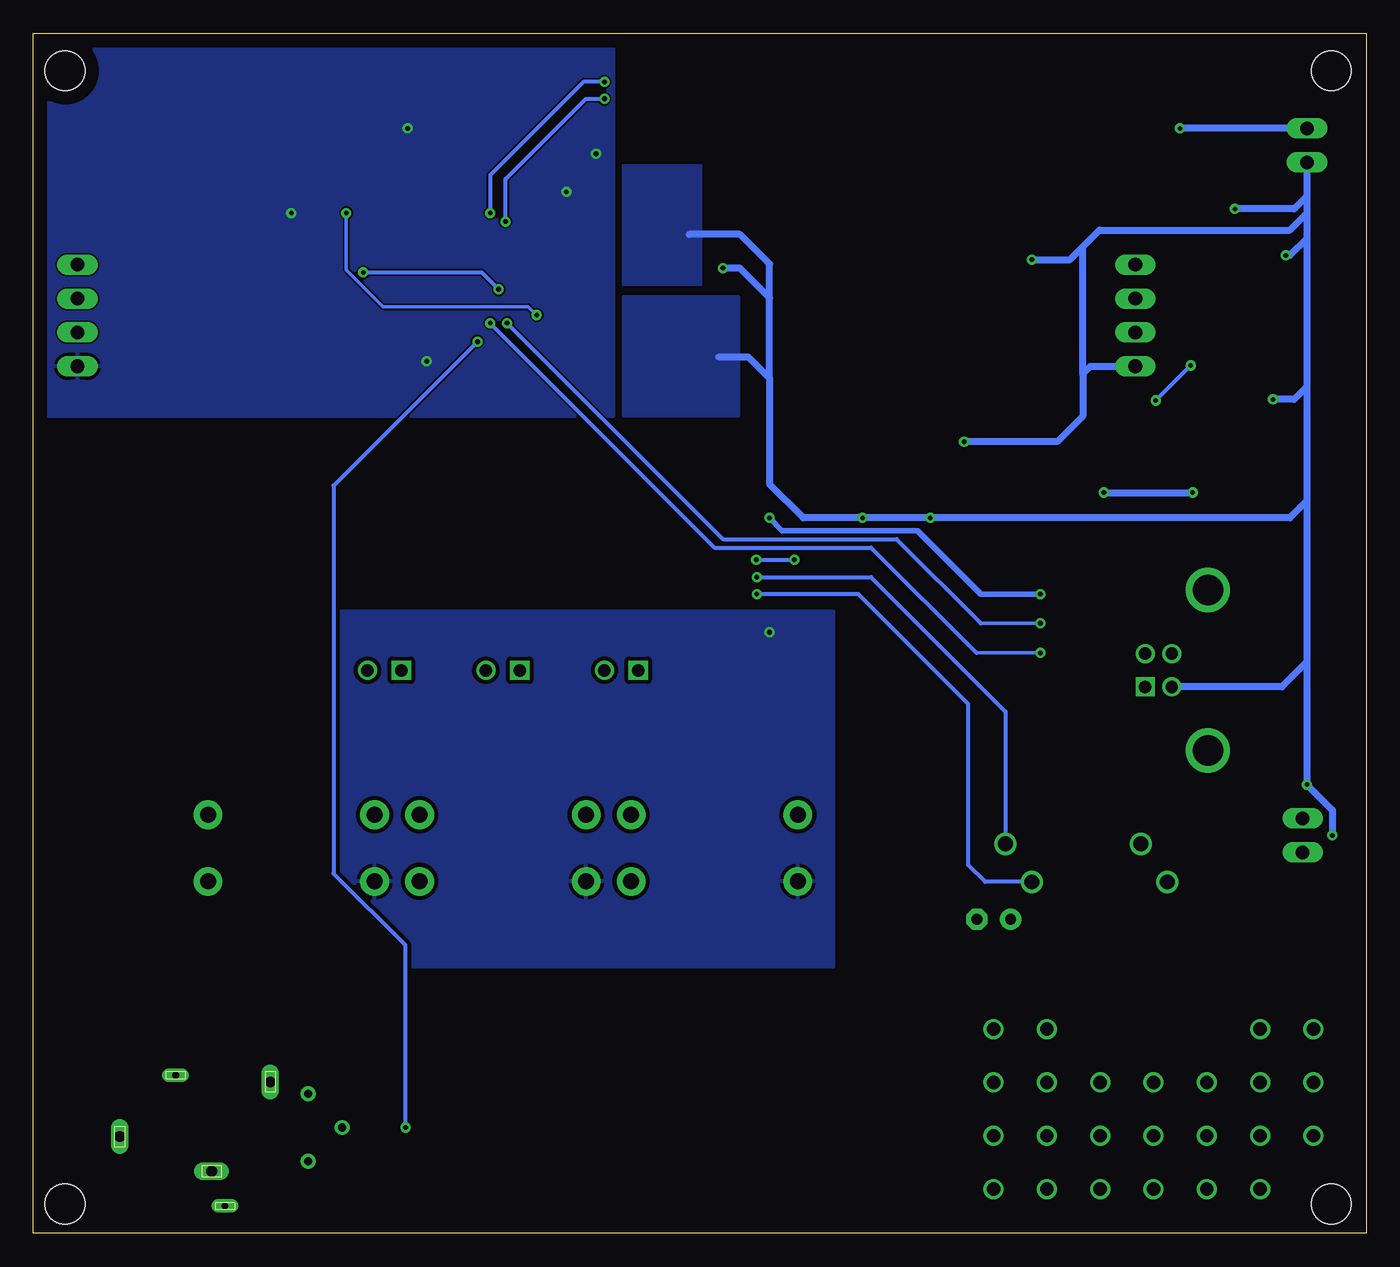
[diagram p5: board, bottom side, seen from below]

Size 100 x 90 mm. Coordinates in mm from the lower left corner, seen from the top.
Outline: 0,0 100,0 100,90 0,90 0,0
Copper layers (1*16): Top 0.035mm / dielectric 1.5mm / Bottom 0.035mm
Design rules "default *": minimum track width 6mil, minimum drill 0.35mm, track to track 5mil, track to pad 0.2mm, pad to pad 5mil, via to via 0.5mm, smd to smd 5mil, copper to edge 40mil, drill to drill 6mil, minimum pad ring 10mil, minimum via ring 8mil, stop-mask expansion 4mil, vias tented up to drill 0mil, thermal gap 10mil
Holes 3 mm at 2.62,87.19 97.61,87.19 2.62,2.19 97.61,2.19

### Footprints (pad centres in the part's own frame; a part is rotated, then mirrored left to right if it is on the bottom)
WENZHOU_PJ324M = drill 0.8 long: 1 0,5.4; 3 2.6,-1.5; 4 -4.1,-5.9 | drill 0.5 long: 2 5.2,-2.5; 5 -4.6,1.2
6410-02 = drill 1.016 long: 1 1.27,0; 2 -1.27,0
SOT95P280X100-5N = smd 1.05 x 0.55: 1 -1.3,0.95; 2 -1.3,0; 3 -1.3,-0.95; 4 1.3,-0.95; 5 1.3,0.95
SW_TS-1187A-B-A-B = smd 1 x 0.75: A -3,1.875; B 3,1.875; C -3,-1.875; D 3,-1.875
C0805 = smd 1.3 x 1.5: 1 -0.95,0; 2 0.95,0
B45181A = drill 0.813 pad 1.6: + -1.27,0 | drill 0.813 pad 1.6 octagon: - 1.27,0
C1206 = smd 1.6 x 1.8: 1 -1.4,0; 2 1.4,0
DIO_TESD5V0L1UC_RJG = smd 0.41 x 0.56: 1 -0.35,0; 2 0.35,0
DO41-10 = drill 1.118: A 5.08,0; C -5.08,0
SOT95P280X145-5N = smd 1.21 x 0.59: 1 -1.255,0.95; 2 -1.255,0; 3 -1.255,-0.95; 4 1.255,-0.95; 5 1.255,0.95
1X04 = drill 1.016 long: 1 -3.81,0; 2 -1.27,0; 3 1.27,0; 4 3.81,0
HRP7_ROM-M = smd 0.787 x 1.854: 1 -3.81,-6.172; 2 -2.54,-6.172; 3 -1.27,-6.172; 4 0,-6.172; 5 1.27,-6.172; 6 2.54,-6.172; 7 3.81,-6.172 | smd 7.48 x 7.49: 8 0,1.051
SOT223 = smd 1.219 x 2.235: 1 -2.311,-3.099; 2 0,-3.099; 3 2.311,-3.099 | smd 3.6 x 2.2: 4 0,3.099
DFE2HCAH1R0MJ0L = smd 0.85 x 2.2: 1 -1.025,0; 2 1.025,0
CHIPLED_0805 = smd 1.2 x 1.2: A 0,-1.05; C 0,1.05
LEDRD254W50D500H1060 = drill 0.93 pad 1.4: A 1.27,0 | drill 0.93 pad 1.4 square: C -1.27,0
TACTILE_SWITCH_PTH_12MM = drill 1.2 pad 2.159: 1 6.25,-2.5; 2 -6.25,-2.5; 3 6.25,2.5; 4 -6.25,2.5
SOIC127P600X175-14N = smd 1.968 x 0.599: 1 -2.473,3.81; 2 -2.473,2.54; 3 -2.473,1.27; 4 -2.473,0; 5 -2.473,-1.27; 6 -2.473,-2.54; 7 -2.473,-3.81; 8 2.473,-3.81; 9 2.473,-2.54; 10 2.473,-1.27; 11 2.473,0; 12 2.473,1.27; 13 2.473,2.54; 14 2.473,3.81
3.2X1.5 = smd 1 x 1.8: 1 -1.25,0; 2 1.25,0
SOT23 = smd 1 x 1.4: 1 -0.95,-1.1; 2 0.95,-1.1; 3 0,1.1
R0805 = smd 1.3 x 1.5: 1 -0.95,0; 2 0.95,0
SOD323-R = smd 0.6 x 0.6: A 1.1,0; C -1.1,0
QFP50P900X900X160-48N = smd 1.56 x 0.28: 1 -4.18,2.75; 2 -4.18,2.25; 3 -4.18,1.75; 4 -4.18,1.25; 5 -4.18,0.75; 6 -4.18,0.25; 7 -4.18,-0.25; 8 -4.18,-0.75; 9 -4.18,-1.25; 10 -4.18,-1.75; 11 -4.18,-2.25; 12 -4.18,-2.75; 25 4.18,-2.75; 26 4.18,-2.25; 27 4.18,-1.75; 28 4.18,-1.25; 29 4.18,-0.75; 30 4.18,-0.25; 31 4.18,0.25; 32 4.18,0.75; 33 4.18,1.25; 34 4.18,1.75; 35 4.18,2.25; 36 4.18,2.75 | smd 0.28 x 1.56: 13 -2.75,-4.18; 14 -2.25,-4.18; 15 -1.75,-4.18; 16 -1.25,-4.18; 17 -0.75,-4.18; 18 -0.25,-4.18; 19 0.25,-4.18; 20 0.75,-4.18; 21 1.25,-4.18; 22 1.75,-4.18; 23 2.25,-4.18; 24 2.75,-4.18; 37 2.75,4.18; 38 2.25,4.18; 39 1.75,4.18; 40 1.25,4.18; 41 0.75,4.18; 42 0.25,4.18; 43 -0.25,4.18; 44 -0.75,4.18; 45 -1.25,4.18; 46 -1.75,4.18; 47 -2.25,4.18; 48 -2.75,4.18
RTRIM64Y = drill 0.61: 1 0,-2.54; 2 -2.54,0; 3 0,2.54
61729-1011BLF = drill 0.92 square: 1 1.25,4.71 | drill 0.92: 2 -1.25,4.71; 3 -1.25,2.71; 4 1.25,2.71 | drill 2.3: SH1 -6.02,0; SH2 6.02,0
CRYSTAL_2-SMD-5X3 = smd 2 x 2.4: 1 -2,0; 2 2,0

### Placement (x,y rotation side)
AUDIO_JACK  88.12,7.25 270 top
BATTERIE  4.45,81.6 270 top
BATTERYCHARGER  15.88,80.33 270 top
BOOT  68.92,82.8 180 top
C1  91.24,65.05 180 top
C2  77.47,78.74 0 top
C4  27.94,23.56 0 top
C6  59.05,76.52 180 top
C7  12.06,71.75 270 top
C8  49.66,68.96 0 top
C9  49.66,62.61 0 top
C10  53.15,78.8 180 top
C11  53.15,72.45 180 top
C12  19.05,40.01 270 top
C13  72.39,72.07 0 top
C14  69.22,63.18 270 top
C15  38.42,63.5 180 top
C16  27.94,57.78 90 top
C17  27.94,62.87 270 top
C18  26.35,75.56 0 top
C19  26.35,70.8 180 top
C26  59.05,74.3 180 top
D2  20.95,40.64 90 top
D3  22.86,43.18 90 top
D4  22.86,45.4 90 top
D8  21.99,29.21 0 top
D9  20,26.35 0 top
DC-MOTOR  4.76,29.84 270 top
DCDC  31.43,61.91 180 top
DISPLAY  17.32,68.84 90 top
H-BRUECKE  15.95,17.46 180 top
IC2  33.34,73.03 270 top
L1  33.02,57.78 90 top
LED1  15.56,87.31 270 top
LED2  11.75,84.77 270 top
LED_LEFT  55.88,42.23 0 top
LED_MIDDLE  64.77,42.23 0 top
LED_RIGHT  73.66,42.23 0 top
LEFT  48.9,28.89 180 top
OPV  72.07,7.94 0 top
POWER_LED  73.03,87.31 270 top
Q1  54.42,75.62 90 top
Q2-N7000  15.56,84.77 90 top
Q3  7.62,60.64 90 top
R1  76.83,87.31 0 top
R2  81.6,78.74 180 top
R3  66.99,78.74 0 top
R4  71.12,78.74 0 top
R5  68.9,87.31 180 top
R6  18.73,80.01 270 top
R7  10.48,80.01 90 top
R8  12.7,80.01 90 top
R9  7.62,67.63 270 top
R10  9.84,67.63 90 top
R11  10.79,60.64 270 top
R12  50.61,65.78 90 top
R13  21.91,47.94 0 top
R15  38.42,60.33 180 top
R16  30.16,65.72 90 top
R17  40.76,77.35 90 top
R18  73.34,2.22 180 top
R19  20.95,80.01 270 top
R20  9.84,71.75 90 top
R21  7.62,71.75 270 top
R25  20,45.72 180 top
R26  20,43.5 180 top
R27  78.42,1.91 0 top
R29  12.06,67.63 270 top
R30  55.69,37.78 180 top
R31  73.47,37.78 180 top
R32  64.57,37.78 180 top
R33  48.05,36.02 180 top
R35  72.59,35.42 0 top
R36  50.05,38.27 0 top
R37  52.2,75.62 90 top
RED_LED  65.09,87.31 270 top
RESET  79.38,82.87 0 top
RIGHT  64.77,28.89 180 top
SCHOTTKY  34.92,61.91 270 top
SCHOTTKY1  9.72,57.78 0 top
SELECT  80.64,28.89 180 top
ST_LINK  96.68,68.84 270 top
STM32  64.82,69.13 0 top
TRIMMER  79.38,7.94 0 top
USB-B  11.88,42.23 270 top
Y1  53.78,65.78 90 top

### Tracks (layer width: path | path; a pad name or v marks a point on that pad's centre or on a via)
+3V3  (via drill 0.35)
  Top 0.254: STM32.1 61.91,71.88 | 61.91,71.88 STM32.36 71.24,71.88 C13.1 | STM32.48 62.07,72.03 61.91,71.88 | STM32.24 68.4,64.95 C14.1 v70.48,65.4 | STM32.9 62.3,67.88 62.99,68.56 62.99,70.8 61.91,71.88
  Top 0.305: BOOT.D BOOT.C | POWER_LED.A 71.97,84.73 BOOT.C | C26.1 C6.1 v60.01,78.11 | STM32.48 61.08,74.3 C26.1 | STM32.1 60.01,72.51 C26.1 | R2.2 v80.65,76.52 v80.64,76.52 | BOOT.C v71.92,82.87 | ST_LINK.4 92.21,65.03 C1.1
  Top 0.406: R13.2 v24.45,47.94
  Top 0.508: 46.67,80.96 42.23,80.96 40.76,79.49 R17.2 | 46.67,80.96 v57.78,80.96 | v44.77,45.09 v44.77,53.66 44.77,79.06 46.67,80.96 | SELECT.3 67.31,19.31 67.31,8.89 68.26,7.94 OPV.4
  Bottom 0.406: v24.45,47.94 28.89,47.94 33.66,52.7 43.81,52.7 v44.77,53.66
  pour Bottom: 56.52,61.28 99.06,61.28 99.06,89.22 56.52,89.22
  pour Bottom (isolate 0.305): 40.01,20 91.12,20 91.12,46.67 40.01,46.67
+5V
  Top 0.305: DISPLAY.2 29.27,67.57 R16.2
  Top 0.508: C19.1 30.15,70.8 30.16,70.79 R16.2
  Top 0.61: 30.15,70.8 IC2.3
BATTERY_LEVEL  (via drill 0.35)
  Top 0.305: v45.76,50.51 51.15,50.51 63.57,62.94 STM32.16 | v42.9,50.51 38.81,54.61 18.1,54.61 15.79,56.92 v15.79,62.46 | R29.2 12.06,66.19 v13.17,65.09 13.17,69.7 C7.2
  Bottom 0.305: v45.76,50.51 v42.9,50.51 | v15.79,62.46 v13.17,65.09
BOOT0
  Top 0.305: R3.2 67.94,77.79 67.62,77.47 64.14,77.47 63.5,76.83 63.5,75.56 64.07,74.99 STM32.44
BUTTON_1
  Top 0.254: 44.91,36.02 72.15,63.26 72.15,65.45 70.73,66.88 STM32.26 | LEFT.1 42.65,33.76 44.91,36.02 | R33.2 44.91,36.02
BUTTON_2
  Top 0.254: RIGHT.1 57.25,31.39 52.62,36.03 | 52.62,36.03 52.62,42.89 72.87,63.14 72.87,65.62 71.12,67.38 STM32.27 | 52.62,36.03 51,37.64 R36.2
BUTTON_3
  Top 0.254: STM32.28 71.51,67.88 73.6,65.79 73.6,63.12 53.34,42.86 53.34,36.51 56.52,33.34 73.34,33.34 74.39,32.28 SELECT.1 74.39,34.57 R35.2
DISPLAY_SCL  (via drill 0.35)
  Top 0.305: v57.15,86.36 29.12,86.36 22.23,79.46 22.23,75.51 19.37,72.65 DISPLAY.4 | STM32.42 65.07,74.93 65.72,75.58 v65.72,76.52
  Bottom 0.305: v57.15,86.36 58.74,86.36 65.72,79.38 v65.72,76.52
DISPLAY_SDA  (via drill 0.35)
  Top 0.305: STM32.43 v64.57,75.88 | DISPLAY.3 19.68,70.11 22.86,73.28 22.86,78.74 29.21,85.09 v57.15,85.09
  Bottom 0.305: v64.57,75.88 64.57,79.06 58.54,85.09 v57.15,85.09
GND  (via drill 0.35)
  Top 0.508: v32.7,53.66 36.2,50.16 36.2,21.59 39.01,18.78 63.18,18.78 65.72,16.24 65.72,3.81 66.99,2.54 69.22,2.54 | v37.78,53.66 41.91,49.53 41.91,45.4
  Bottom 0.305: v65.09,70.8 66.36,72.07 v75.25,72.07
  Bottom 0.508: BATTERIE.1 4.45,77.79 | 4.45,77.79 4.45,76.52 | 4.45,76.52 4.45,74.61 | 4.45,74.61 4.45,63.5 | 4.45,63.5 4.45,54.93 | USB-B.4 6.33,40.98 4.45,42.86 | 4.45,63.5 5.4,62.55 v6.99,62.55 | 4.45,77.79 5.4,76.83 v9.84,76.83 | 4.45,54.93 4.45,42.86 | 4.45,54.93 5.71,53.66 v32.7,53.66 v37.78,53.66 42.23,53.66 44.77,56.2 44.77,64.14 | 21.27,64.45 21.27,73.98 | 21.27,64.45 20.7,65.03 DISPLAY.1 | 44.77,64.14 46.35,65.72 48.58,65.72 | 44.77,64.14 44.77,70.17 | 44.77,70.17 44.77,72.71 46.99,74.93 50.8,74.93 | 44.77,70.17 46.99,72.39 v48.26,72.39 | 21.27,64.45 21.27,61.28 23.18,59.37 v30.16,59.37 | 21.27,73.98 20,75.25 5.71,75.25 4.45,76.52 | 21.27,73.98 22.23,73.03 v25.08,73.03 | 4.45,42.86 v4.45,33.66 2.54,31.75 v2.54,29.84 | 4.45,74.61 5.71,73.34 v6.03,73.34
  pour Top (isolate 0.305, no thermals): 33.34,61.59 31.11,61.59 31.11,58.1 26.67,58.1 26.67,62.23 33.34,62.23
  pour Top (isolate 0.305): 30.8,33.97 0.95,33.97 0.95,20.95 30.8,20.95
  pour Top (isolate 0.305): 25.4,34.92 0.95,34.92 0.95,50.48 25.4,50.48
  pour Top (isolate 0.305): 14.61,64.14 5.71,64.14 5.71,73.98 14.61,73.98
  pour Top (isolate 0.305): 13.02,62.87 13.02,56.52 5.71,56.52 5.71,62.87
  pour Bottom (isolate 0.305): 55.69,70.23 47.12,70.23 47.12,61.34 55.69,61.34
  pour Bottom (isolate 0.305): 49.98,80.07 49.98,71.18 55.69,71.18 55.69,80.07
  pour Top (isolate 0.305): 99.38,0.64 67.94,0.64 67.94,13.34 99.38,13.34
  pour Top: 100.33,60.64 46.35,60.64 46.35,89.85 100.33,89.85
  pour Top (isolate 0.305): 40.01,20 91.12,20 91.12,46.67 40.01,46.67
  pour Top: 23.5,77.15 32.07,77.15 32.07,68.9 23.5,68.9
  pour Top (isolate 0.305): 9.21,76.2 22.23,76.2 22.23,88.58 9.21,88.58
LED_LEFT
  Top 0.254: LED_LEFT.A 74.32,59.4 74.32,65.96 71.9,68.38 STM32.29
LED_MIDDLE
  Top 0.254: STM32.30 72.3,68.88 75.05,66.13 75.05,51.23 LED_MIDDLE.A
LED_RIGHT
  Top 0.254: LED_RIGHT.A 75.56,42.86 75.56,66.5 72.69,69.38 STM32.31
MOTOR_PWM1  (via drill 0.35)
  Top 0.305: STM32.18 64.57,62.97 50.81,49.21 v45.72,49.21
  Bottom 0.305: v45.72,49.21 37.15,49.21 27.07,39.13 D8.A
MOTOR_PWM2  (via drill 0.35)
  Top 0.305: STM32.19 65.07,62.53 50.48,47.94 v45.72,47.94
  Bottom 0.305: D9.A 28.57,26.35 29.84,27.62 29.84,39.69 38.1,47.94 v45.72,47.94
MOTORA
  Top 0.508: H-BRUECKE.2 18.49,29.69 17.07,31.11 DC-MOTOR.2
MOTORB
  Top 0.508: DC-MOTOR.1 10.79,28.57 13.41,25.96 H-BRUECKE.6
N$1
  pour Top (isolate 0.305, no thermals): 31.43,61.28 31.43,58.1 38.42,58.1 38.42,61.28
N$2
  Top 0.305: RED_LED.C R5.2
N$3
  Top 0.305: POWER_LED.C R1.1
N$4
  Top 0.508: R9.2 R10.1
N$5
  Top 0.305: R3.1 65.92,78.86 BOOT.B BOOT.A 71.92,78.89 R4.2
N$6
  Top 0.305: D8.C 17.22,28.89 H-BRUECKE.3
N$7
  pour Top (no thermals): 26.67,62.55 38.42,62.55 38.42,65.41 26.67,65.41
N$8
  Top 0.508: BATTERYCHARGER.5 16.86,79.06 R6.2 R19.2
N$9
  Top 0.508: BATTERYCHARGER.1 16.82,83.66 Q2-N7000.1 16.62,83.78 13.36,83.78 12.8,84.34 | LED2.C 12.8,84.34 | 12.8,84.34 12.8,81.06 R8.2
N$10
  pour Top (isolate 0.305, no thermals): 38.73,59.37 38.73,64.45 40.32,64.45 40.32,59.37
N$11
  Top 0.508: LED1.A 11.97,87.31 10.7,86.04 LED2.A 10.7,81.18 R7.2
N$12
  Top 0.508: LED1.C 16.66,87.26 Q2-N7000.2
N$13
  Top 0.406: C18.1 26.34,74.18 31.99,74.18 33.14,73.03 IC2.4
  pour Top (no thermals): 35.24,75.25 35.24,70.8 37.15,68.9 37.47,68.9 43.81,68.9 43.81,77.15 37.15,77.15
N$14
  Top 0.305: H-BRUECKE.5 14.68,26.11 D9.C
N$15  (via drill 1)
  other vias: 7.95,3.32
N$16
  Top 0.305: OPV.9 TRIMMER.1 R27.2
N$17  (via drill 1)
  other vias: 11.95,3.32
N$18  (via drill 1)
  other vias: 15.95,3.32
N$19
  Top 0.305: R30.2 54.61,37.91 LED_LEFT.C
N$20
  Top 0.305: R31.2 72.39,37.91 LED_RIGHT.C
N$21  (via drill 1)
  other vias: 19.95,3.32
N$22  (via drill 1)
  other vias: 23.95,3.32
N$23
  Top 0.305: R32.2 63.5,37.9 LED_MIDDLE.C
N$24  (via drill 1)
  other vias: 27.95,3.32
N$25  (via drill 1)
  other vias: 27.95,7.32
N$26  (via drill 1)
  other vias: 23.95,7.32
N$27  (via drill 1)
  other vias: 19.95,7.32
N$28  (via drill 1)
  other vias: 15.95,7.32
N$29
  Top 0.406: USB-B.3 14.59,45.09 15.22,45.72 R25.2
N$30
  Top 0.406: R26.2 19.04,43.48 USB-B.2
N$31  (via drill 1)
  other vias: 11.95,7.32
N$32  (via drill 1)
  other vias: 7.95,7.32
N$33  (via drill 1)
  other vias: 3.95,7.32
N$34  (via drill 1)
  other vias: 3.95,11.32
N$35  (via drill 1)
  other vias: 7.95,11.32
N$36  (via drill 1)
  other vias: 11.95,11.32
N$37  (via drill 1)
  other vias: 15.95,11.32
N$38  (via drill 1)
  other vias: 19.95,11.32
N$40  (via drill 1)
  other vias: 27.95,11.32
N$41  (via drill 1)
  other vias: 27.95,15.32
N$42  (via drill 1)
  other vias: 23.95,15.32
N$43  (via drill 1)
  other vias: 3.95,15.32
N$44  (via drill 1)
  other vias: 7.95,15.32
N$45  (via drill 0.35)
  Top 0.305: R18.2 72.07,2.54 v72.07,7.94 | STM32.11 v66.67,66.87
  Bottom 0.305: v72.07,7.94 72.07,21.59 77.47,26.99 77.47,56.08 v66.67,66.87
N$46
  Top 0.508: R21.1 R20.2
N$47
  Top 0.508: R20.1 R10.2 R29.1
OSC32IN
  Top 0.254: Q1.2 56.16,76.88 56.83,76.2 56.83,72.39 58.35,70.88 STM32.3
  Top 0.305: C10.2 R37.2 52.5,76.88 Q1.2
OSC32OUT
  Top 0.254: Q1.1 55.48,74.38 55.88,73.98 55.88,72.39 57.89,70.38 STM32.4
  Top 0.305: C11.2 R37.1 52.5,74.38 Q1.1
OSCIN
  Top 0.254: STM32.5 57.81,69.88 55.72,67.78 Y1.2
  Top 0.305: C8.2 R12.2 52.73,66.73 Y1.2
OSCOUT
  Top 0.254: STM32.6 58.28,69.38 57.28,68.37 57.28,64.73 56.33,63.78 Y1.1
  Top 0.305: C9.2 R12.1 52.73,64.83 Y1.1
PAD  (via drill 1)
  other vias: 23.95,11.32
  pour Top (isolate 0.305, no thermals): 0.95,0.32 30.95,0.32 30.95,20.32 0.95,20.32
PC13
  Top 0.152: 59.05,77.47 59.05,73.34
  Top 0.203: 59.05,77.79 59.05,77.47 | 59.05,73.34 59.05,73.03
  Top 0.254: 59.05,78.42 59.05,77.79 | 59.05,73.03 59.05,72.71
  Top 0.305: RED_LED.A 62.23,87.31 59.05,84.14 59.05,78.42 | 59.05,72.71 59.05,71.75 59.43,71.38 STM32.2
RESET  (via drill 0.35)
  Top 0.254: STM32.7 v62.23,68.88 | v76.52,76.52 C2.1
  Top 0.305: C2.1 76.38,78.89 RESET.C RESET.D 82.55,80.82 R2.1
  Bottom 0.254: v62.23,68.88 62.87,69.51 73.76,69.51 76.52,72.27 v76.52,76.52
SIGNAL_IN
  Top 0.305: AUDIO_JACK.2 81.01,6.67 | 81.01,6.67 OPV.10 | AUDIO_JACK.5 84.14,6.67 81.01,6.67
SIGNAL_OPAMP
  Top 0.305: R27.1 77.47,3.17 76.52,4.13 OPV.8 74.55,2.48 R18.1
SWDCLK
  Top 0.254: ST_LINK.2 94.04,70.11 90.84,73.31 STM32.37
SWDIO
  Top 0.254: ST_LINK.3 94.36,67.57 91.05,70.88 STM32.34
USB+  (via drill 0.35)
  Top 0.254: D4.2 v24.45,45.75
  Top 0.305: STM32.33 66.57,70.38 v64.45,68.26
  Top 0.406: D4.2 20.98,45.75 R25.1 R13.1
  Bottom 0.254: 28.93,45.75 v24.45,45.75
  Bottom 0.305: 28.93,45.75 35.24,52.07 48.26,52.07 v64.45,68.26
USB-  (via drill 0.35)
  Top 0.254: D3.2 v24.45,43.53
  Top 0.305: STM32.32 67.34,69.88 v65.72,68.26
  Top 0.406: R26.1 20.98,43.53 D3.2
  Bottom 0.254: 29.24,43.53 v24.45,43.53
  Bottom 0.305: 29.24,43.53 37.15,51.44 48.9,51.44 v65.72,68.26
VBAT  (via drill 0.35)
  Top 0.508: v13.97,82.87 14.61,82.87 14.93,82.55 BATTERYCHARGER.3 | BATTERIE.2 2.86,82.87 1.59,81.6 1.59,73.03 | 1.59,62.55 2.5,61.63 8.68,61.63 Q3.2 | 1.59,73.03 1.59,62.55 | 1.59,62.55 1.59,33.97 | 1.59,33.97 1.59,28.89 3.49,26.99 10.38,26.99 12.14,25.22 H-BRUECKE.7 | C4.+ 19.84,23.56 H-BRUECKE.1 19.76,30.48 17.86,32.38 3.17,32.38 1.59,33.97 | 1.59,73.03 3.81,70.81 R21.2
  Bottom 0.508: BATTERIE.2 v13.97,82.87
VBUS
  Top 0.305: 19.05,40.98 C12.1 | BATTERYCHARGER.4 | 12.7,79.03 R8.1
  Top 0.406: C12.1 19.02,40.98 USB-B.1 15.47,39.86 14.12,39.86 13.47,40.52 13.47,45.85 14.92,47.31 14.92,56.83 13.97,57.78 | D2.2 19.05,40.98 | BATTERYCHARGER.4 14.92,58.74 13.97,57.78 | SCHOTTKY1.A 13.97,57.78
  Top 0.508: R7.1 10.51,79.03 12.7,79.03 | R8.1 14.89,79.06 BATTERYCHARGER.4 | Q3.1 R11.2 10.82,59.66 SCHOTTKY1.A
VIN  (via drill 0.35)
  Top 0.508: Q3.3 6.52,58.87 7.61,57.78 | C16.1 20.51,56.38 v19.68,55.56 | v13.02,55.56 9.84,55.56 8.62,56.78 8.61,56.78 7.61,57.78 | 7.61,57.78 SCHOTTKY1.C
  Bottom 0.508: v19.68,55.56 v13.02,55.56
  pour Top (isolate 0.305, no thermals): 38.42,57.47 38.42,55.56 26.67,55.56 26.67,57.47
(copper drawn outside any net)
  shapes: Top area x2236

### Text on the board
Top: Gabriel Unterweger / AutoTuner - 5BEL - V1
tStop: Gabriel Unterweger / AutoTuner - 5BEL - V1
Einteilung: Boot | Reset | BAT Charger | 5V->3V3 | VBAT LVL | V Selection | DCDC | USB | DC Driver | Buttons / LEDs | A_IN